# Altium project Scaffold.PrjPcb (part 1 of 2)
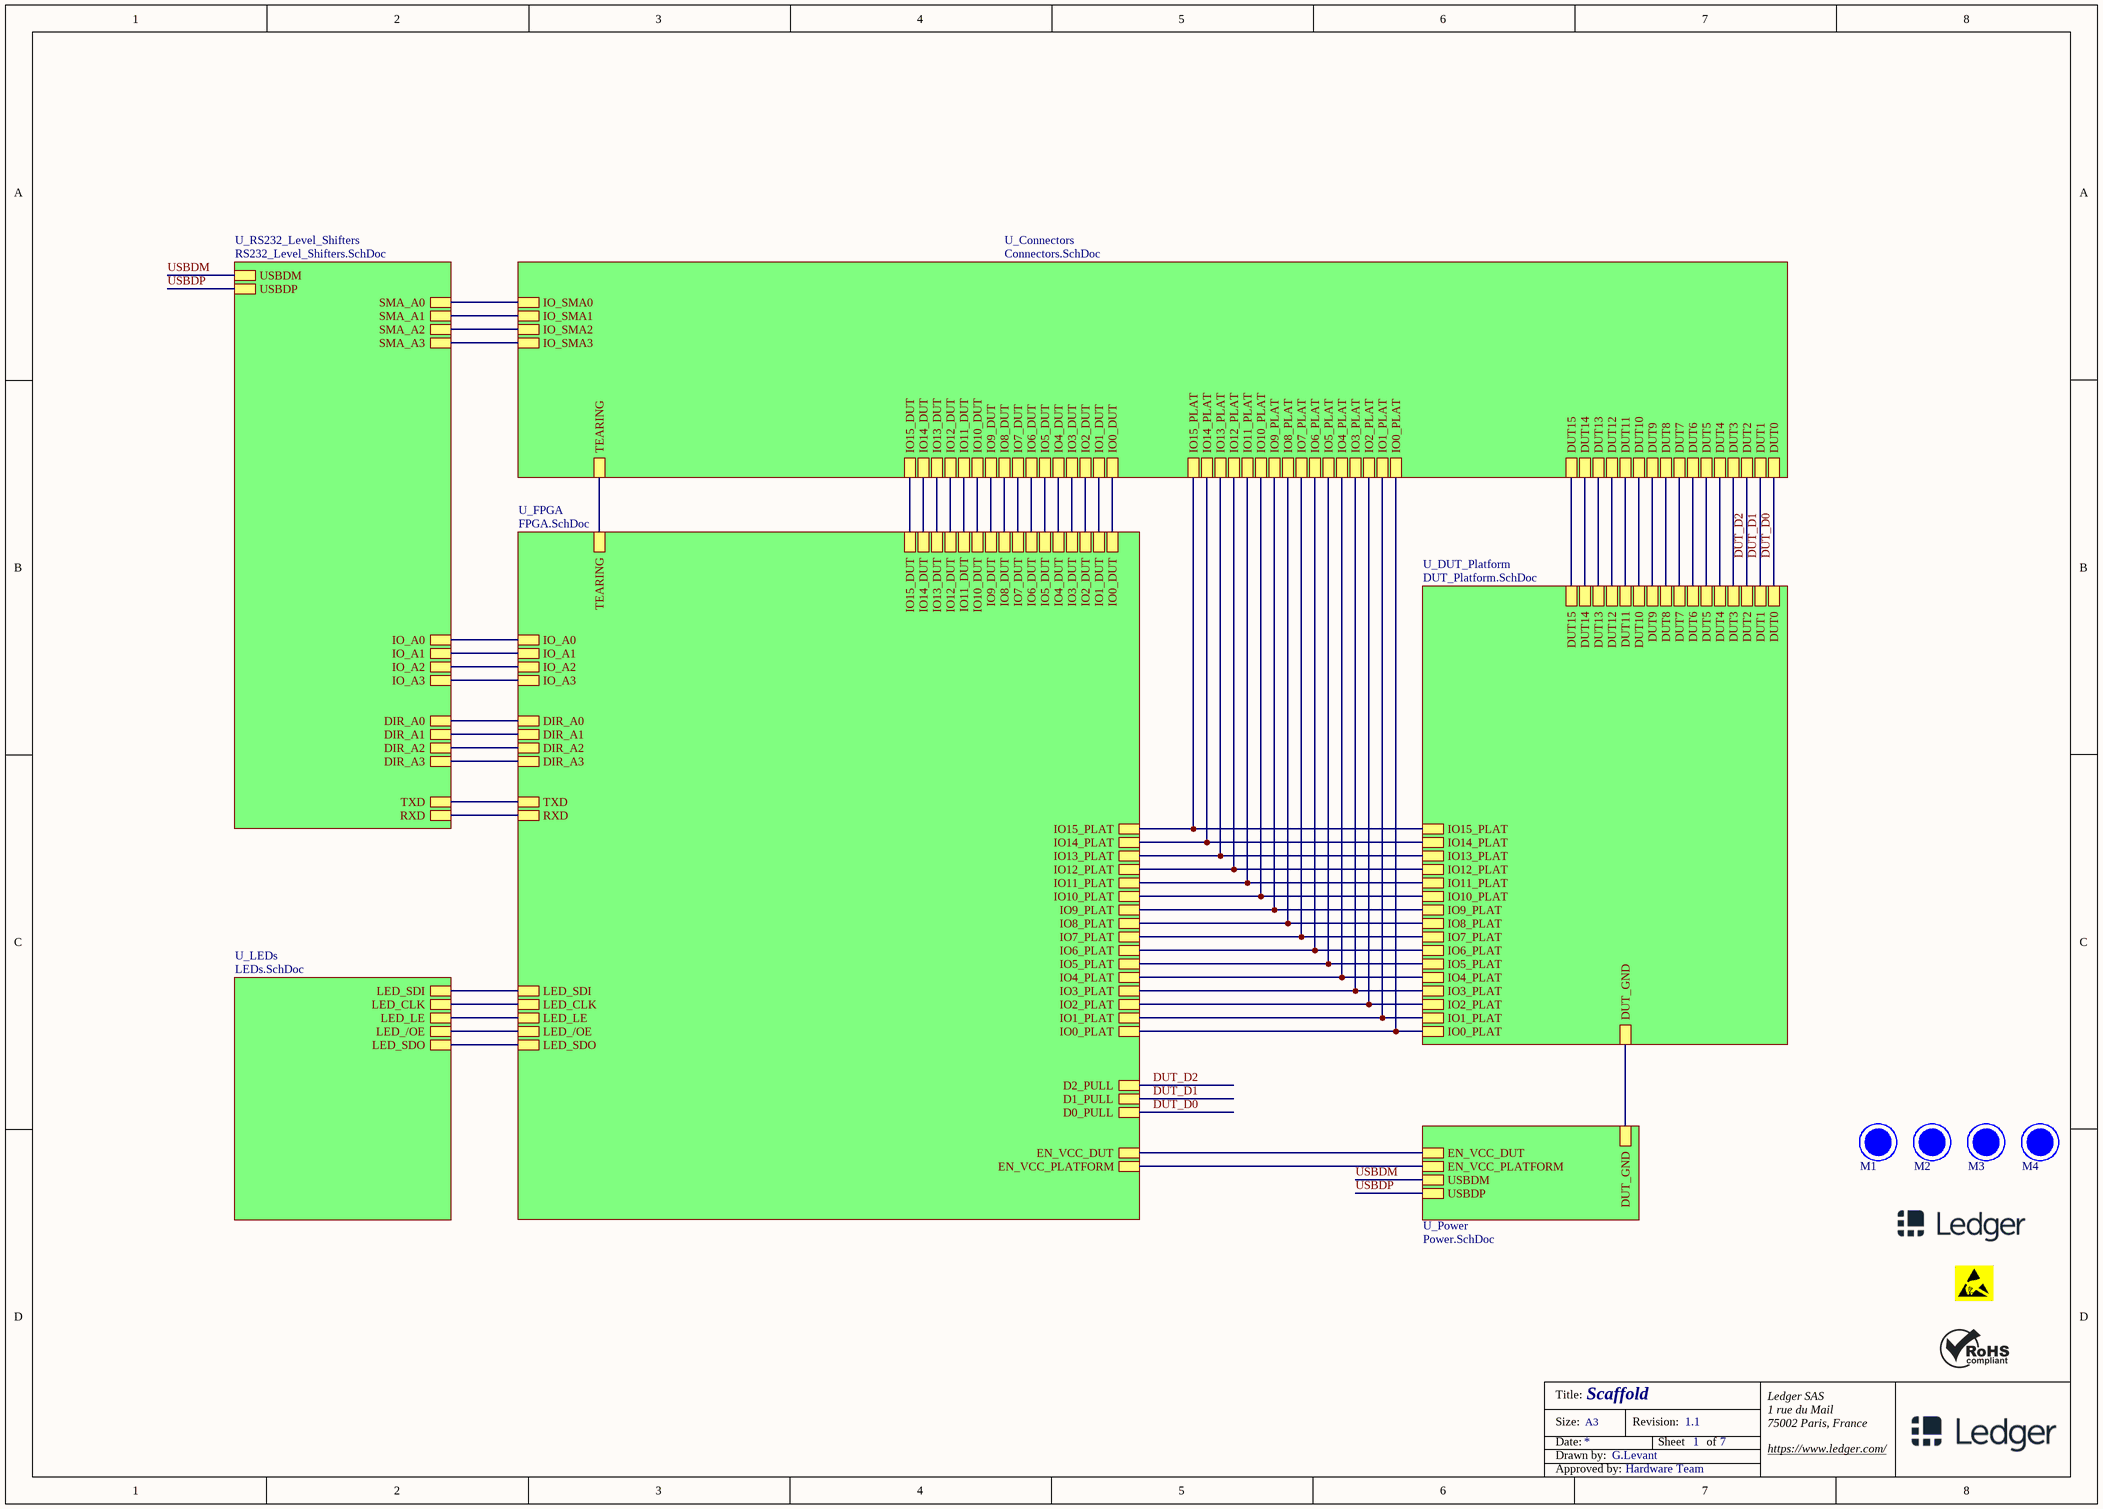
[diagram p0: Scaffold.SchDoc]
ELECApproved: Hardware Team; ELECDrawn: G.Levant; Nom_Projet: Scaffold; PageTot: 7; Rev: 1.1
7 sheets, 332 parts. Net scope: hierarchical (ports join the sheet entries above them; power ports are global).
Board file: Scaffold.PcbDoc
Sheets:
  Scaffold.SchDoc
    U_Power = Power.SchDoc
    U_LEDs = LEDs.SchDoc
    U_FPGA = FPGA.SchDoc
    U_DUT_Platform = DUT_Platform.SchDoc
    U_Connectors = Connectors.SchDoc
    U_RS232_Level_Shifters = RS232_Level_Shifters.SchDoc

## Sheet Scaffold.SchDoc
size A3; SheetNumber: 1; SheetTotal: 7

### Parts
Logo1  Logo Ledger  [logo_Ledger_new - Horizontale]  (value not drawn)  (no BOM)
Logo2  Logo ESD  [LOGO ESD]  (value not drawn)  (no BOM)
Logo3  Logo ROHS  [Logo ROHS]  (value not drawn)  (no BOM)
M1  Mire  [MIRE]  (value not drawn)  (no BOM)
M2  Mire  [MIRE]  (value not drawn)  (no BOM)
M3  Mire  [MIRE]  (value not drawn)  (no BOM)
M4  Mire  [MIRE]  (value not drawn)  (no BOM)

### Sub-sheets
U_Connectors = Connectors.SchDoc: IO_SMA1, IO_SMA0, IO_SMA3, IO_SMA2, TEARING, DUT3, DUT2, DUT1, DUT0, DUT5, DUT6, DUT7, IO3_DUT, IO2_DUT, IO1_DUT, IO0_DUT, IO4_DUT, IO5_DUT, IO6_DUT, IO7_DUT, DUT11, DUT10, DUT9, DUT8, DUT12, DUT13, DUT14, DUT15, IO11_DUT, IO10_DUT, IO9_DUT, IO8_DUT, IO12_DUT, IO13_DUT, IO14_DUT, IO15_DUT, IO8_PLAT, IO10_PLAT, IO12_PLAT, IO14_PLAT, IO9_PLAT, IO11_PLAT, IO13_PLAT, IO15_PLAT, IO0_PLAT, IO2_PLAT, IO4_PLAT, IO6_PLAT, IO1_PLAT, IO3_PLAT, IO5_PLAT, IO7_PLAT, DUT4
U_DUT_Platform = DUT_Platform.SchDoc: IO15_PLAT, IO14_PLAT, IO13_PLAT, IO12_PLAT, IO11_PLAT, IO10_PLAT, IO9_PLAT, IO8_PLAT, IO7_PLAT, IO6_PLAT, IO5_PLAT, IO4_PLAT, IO3_PLAT, IO2_PLAT, IO1_PLAT, IO0_PLAT, DUT7, DUT15, DUT14, DUT13, DUT12, DUT11, DUT10, DUT9, DUT8, DUT6, DUT5, DUT4, DUT3, DUT2, DUT1, DUT0, DUT_GND
U_FPGA = FPGA.SchDoc: EN_VCC_PLATFORM, EN_VCC_DUT, IO_A0, IO_A1, IO_A2, IO_A3, TEARING, LED_SDI, LED_CLK, LED_LE, LED_/OE, LED_SDO, IO0_DUT, IO0_PLAT, IO1_DUT, IO1_PLAT, IO2_DUT, IO2_PLAT, IO3_DUT, IO3_PLAT, IO11_DUT, IO11_PLAT, IO12_DUT, IO12_PLAT, IO13_DUT, IO13_PLAT, IO14_DUT, IO14_PLAT, IO15_DUT, IO15_PLAT, IO7_DUT, IO7_PLAT, IO8_DUT, IO8_PLAT, IO9_DUT, IO9_PLAT, IO10_DUT, IO10_PLAT, IO4_DUT, IO4_PLAT, IO5_DUT, IO5_PLAT, IO6_DUT, IO6_PLAT, RXD, TXD, DIR_A1, DIR_A0, DIR_A2, DIR_A3, D2_PULL, D1_PULL, D0_PULL
U_LEDs = LEDs.SchDoc: LED_SDI, LED_CLK, LED_/OE, LED_LE, LED_SDO
U_Power = Power.SchDoc: DUT_GND, EN_VCC_DUT, EN_VCC_PLATFORM, USBDM, USBDP
U_RS232_Level_Shifters = RS232_Level_Shifters.SchDoc: USBDM, USBDP, SMA_A0, SMA_A1, RXD, TXD, IO_A0, IO_A1, IO_A2, SMA_A2, IO_A3, SMA_A3, DIR_A1, DIR_A0, DIR_A2, DIR_A3

### Nets
DUT_D0: sheet U_FPGA/D0_PULL, sheet U_DUT_Platform/DUT0, sheet U_Connectors/DUT0
DUT_D1: sheet U_FPGA/D1_PULL, sheet U_DUT_Platform/DUT1, sheet U_Connectors/DUT1
DUT_D2: sheet U_FPGA/D2_PULL, sheet U_DUT_Platform/DUT2, sheet U_Connectors/DUT2
IO0_DUT: sheet U_FPGA/IO0_DUT, sheet U_Connectors/IO0_DUT
IO1_DUT: sheet U_FPGA/IO1_DUT, sheet U_Connectors/IO1_DUT
IO2_DUT: sheet U_FPGA/IO2_DUT, sheet U_Connectors/IO2_DUT
IO3_DUT: sheet U_FPGA/IO3_DUT, sheet U_Connectors/IO3_DUT
IO4_DUT: sheet U_FPGA/IO4_DUT, sheet U_Connectors/IO4_DUT
IO5_DUT: sheet U_FPGA/IO5_DUT, sheet U_Connectors/IO5_DUT
IO6_DUT: sheet U_FPGA/IO6_DUT, sheet U_Connectors/IO6_DUT
IO7_DUT: sheet U_FPGA/IO7_DUT, sheet U_Connectors/IO7_DUT
IO8_DUT: sheet U_FPGA/IO8_DUT, sheet U_Connectors/IO8_DUT
IO9_DUT: sheet U_FPGA/IO9_DUT, sheet U_Connectors/IO9_DUT
IO10_DUT: sheet U_FPGA/IO10_DUT, sheet U_Connectors/IO10_DUT
IO11_DUT: sheet U_FPGA/IO11_DUT, sheet U_Connectors/IO11_DUT
IO12_DUT: sheet U_FPGA/IO12_DUT, sheet U_Connectors/IO12_DUT
IO13_DUT: sheet U_FPGA/IO13_DUT, sheet U_Connectors/IO13_DUT
IO14_DUT: sheet U_FPGA/IO14_DUT, sheet U_Connectors/IO14_DUT
IO15_DUT: sheet U_FPGA/IO15_DUT, sheet U_Connectors/IO15_DUT
LED_/OE: sheet U_LEDs/LED_/OE, sheet U_FPGA/LED_/OE
LED_CLK: sheet U_LEDs/LED_CLK, sheet U_FPGA/LED_CLK
LED_LE: sheet U_LEDs/LED_LE, sheet U_FPGA/LED_LE
USBDM: sheet U_Power/USBDM, sheet U_RS232_Level_Shifters/USBDM
USBDP: sheet U_Power/USBDP, sheet U_RS232_Level_Shifters/USBDP
NetCN207_1: sheet U_Power/DUT_GND, sheet U_DUT_Platform/DUT_GND
NetJ500_1: sheet U_FPGA/IO1_PLAT, sheet U_DUT_Platform/IO1_PLAT, sheet U_Connectors/IO1_PLAT
NetJ500_2: sheet U_FPGA/IO0_PLAT, sheet U_DUT_Platform/IO0_PLAT, sheet U_Connectors/IO0_PLAT
NetJ500_3: sheet U_FPGA/IO3_PLAT, sheet U_DUT_Platform/IO3_PLAT, sheet U_Connectors/IO3_PLAT
NetJ500_4: sheet U_FPGA/IO2_PLAT, sheet U_DUT_Platform/IO2_PLAT, sheet U_Connectors/IO2_PLAT
NetJ500_5: sheet U_FPGA/IO5_PLAT, sheet U_DUT_Platform/IO5_PLAT, sheet U_Connectors/IO5_PLAT
NetJ500_6: sheet U_FPGA/IO4_PLAT, sheet U_DUT_Platform/IO4_PLAT, sheet U_Connectors/IO4_PLAT
NetJ500_7: sheet U_FPGA/IO7_PLAT, sheet U_DUT_Platform/IO7_PLAT, sheet U_Connectors/IO7_PLAT
NetJ500_8: sheet U_FPGA/IO6_PLAT, sheet U_DUT_Platform/IO6_PLAT, sheet U_Connectors/IO6_PLAT
NetJ500_9: sheet U_FPGA/IO9_PLAT, sheet U_DUT_Platform/IO9_PLAT, sheet U_Connectors/IO9_PLAT
NetJ500_10: sheet U_FPGA/IO8_PLAT, sheet U_DUT_Platform/IO8_PLAT, sheet U_Connectors/IO8_PLAT
NetJ500_11: sheet U_FPGA/IO11_PLAT, sheet U_DUT_Platform/IO11_PLAT, sheet U_Connectors/IO11_PLAT
NetJ500_12: sheet U_FPGA/IO10_PLAT, sheet U_DUT_Platform/IO10_PLAT, sheet U_Connectors/IO10_PLAT
NetJ500_13: sheet U_FPGA/IO13_PLAT, sheet U_DUT_Platform/IO13_PLAT, sheet U_Connectors/IO13_PLAT
NetJ500_14: sheet U_FPGA/IO12_PLAT, sheet U_DUT_Platform/IO12_PLAT, sheet U_Connectors/IO12_PLAT
NetJ500_15: sheet U_FPGA/IO15_PLAT, sheet U_DUT_Platform/IO15_PLAT, sheet U_Connectors/IO15_PLAT
NetJ500_16: sheet U_FPGA/IO14_PLAT, sheet U_DUT_Platform/IO14_PLAT, sheet U_Connectors/IO14_PLAT
NetJ503_3: sheet U_DUT_Platform/DUT3, sheet U_Connectors/DUT3
NetJ503_5: sheet U_DUT_Platform/DUT5, sheet U_Connectors/DUT5
NetJ503_6: sheet U_DUT_Platform/DUT4, sheet U_Connectors/DUT4
NetJ503_7: sheet U_DUT_Platform/DUT7, sheet U_Connectors/DUT7
NetJ503_8: sheet U_DUT_Platform/DUT6, sheet U_Connectors/DUT6
NetJ503_9: sheet U_DUT_Platform/DUT9, sheet U_Connectors/DUT9
NetJ503_10: sheet U_DUT_Platform/DUT8, sheet U_Connectors/DUT8
NetJ503_11: sheet U_DUT_Platform/DUT11, sheet U_Connectors/DUT11
NetJ503_12: sheet U_DUT_Platform/DUT10, sheet U_Connectors/DUT10
NetJ503_13: sheet U_DUT_Platform/DUT13, sheet U_Connectors/DUT13
NetJ503_14: sheet U_DUT_Platform/DUT12, sheet U_Connectors/DUT12
NetJ503_15: sheet U_DUT_Platform/DUT15, sheet U_Connectors/DUT15
NetJ503_16: sheet U_DUT_Platform/DUT14, sheet U_Connectors/DUT14
NetQ202_3: sheet U_Power/EN_VCC_PLATFORM, sheet U_FPGA/EN_VCC_PLATFORM
NetQ205_3: sheet U_Power/EN_VCC_DUT, sheet U_FPGA/EN_VCC_DUT
NetR300_1: sheet U_FPGA/TEARING, sheet U_Connectors/TEARING
NetR336_1: sheet U_Connectors/IO_SMA2, sheet U_RS232_Level_Shifters/SMA_A2
NetR337_1: sheet U_Connectors/IO_SMA3, sheet U_RS232_Level_Shifters/SMA_A3
NetR344_1: sheet U_Connectors/IO_SMA0, sheet U_RS232_Level_Shifters/SMA_A0
NetR345_1: sheet U_Connectors/IO_SMA1, sheet U_RS232_Level_Shifters/SMA_A1
NetR600_1: sheet U_FPGA/DIR_A0, sheet U_RS232_Level_Shifters/DIR_A0
NetR601_1: sheet U_FPGA/DIR_A1, sheet U_RS232_Level_Shifters/DIR_A1
NetR602_1: sheet U_FPGA/DIR_A2, sheet U_RS232_Level_Shifters/DIR_A2
NetR604_1: sheet U_FPGA/DIR_A3, sheet U_RS232_Level_Shifters/DIR_A3
NetTP403_1: sheet U_LEDs/LED_SDI, sheet U_FPGA/LED_SDI
NetTP405_1: sheet U_LEDs/LED_SDO, sheet U_FPGA/LED_SDO
NetTP600_1: sheet U_FPGA/RXD, sheet U_RS232_Level_Shifters/RXD
NetTP602_1: sheet U_FPGA/TXD, sheet U_RS232_Level_Shifters/TXD
NetU100_30: sheet U_FPGA/IO_A0, sheet U_RS232_Level_Shifters/IO_A0
NetU100_31: sheet U_FPGA/IO_A1, sheet U_RS232_Level_Shifters/IO_A1
NetU100_32: sheet U_FPGA/IO_A2, sheet U_RS232_Level_Shifters/IO_A2
NetU100_33: sheet U_FPGA/IO_A3, sheet U_RS232_Level_Shifters/IO_A3

### Notes on the sheet
- Title:
- Size:
- Date:
- Drawn by:
- A3
- Revision:
- Sheet
- of
- Ledger SAS
- 1 rue du Mail
- 75002 Paris, France
- https://www.ledger.com/
- Approved by:

### Library data of the parts
Logo1 = Misc - Logo Ledger: Misc -  Logo Ledger
Logo2 = Misc - Logo ESD: Misc -  Logo ESD
Logo3 = Misc - Logo ROHS: Misc -  Logo ROHS
M1-M4 = Misc - Mire: Misc -  Mire

## Sheet Power.SchDoc
size A3; SheetNumber: 3; SheetTotal: 7
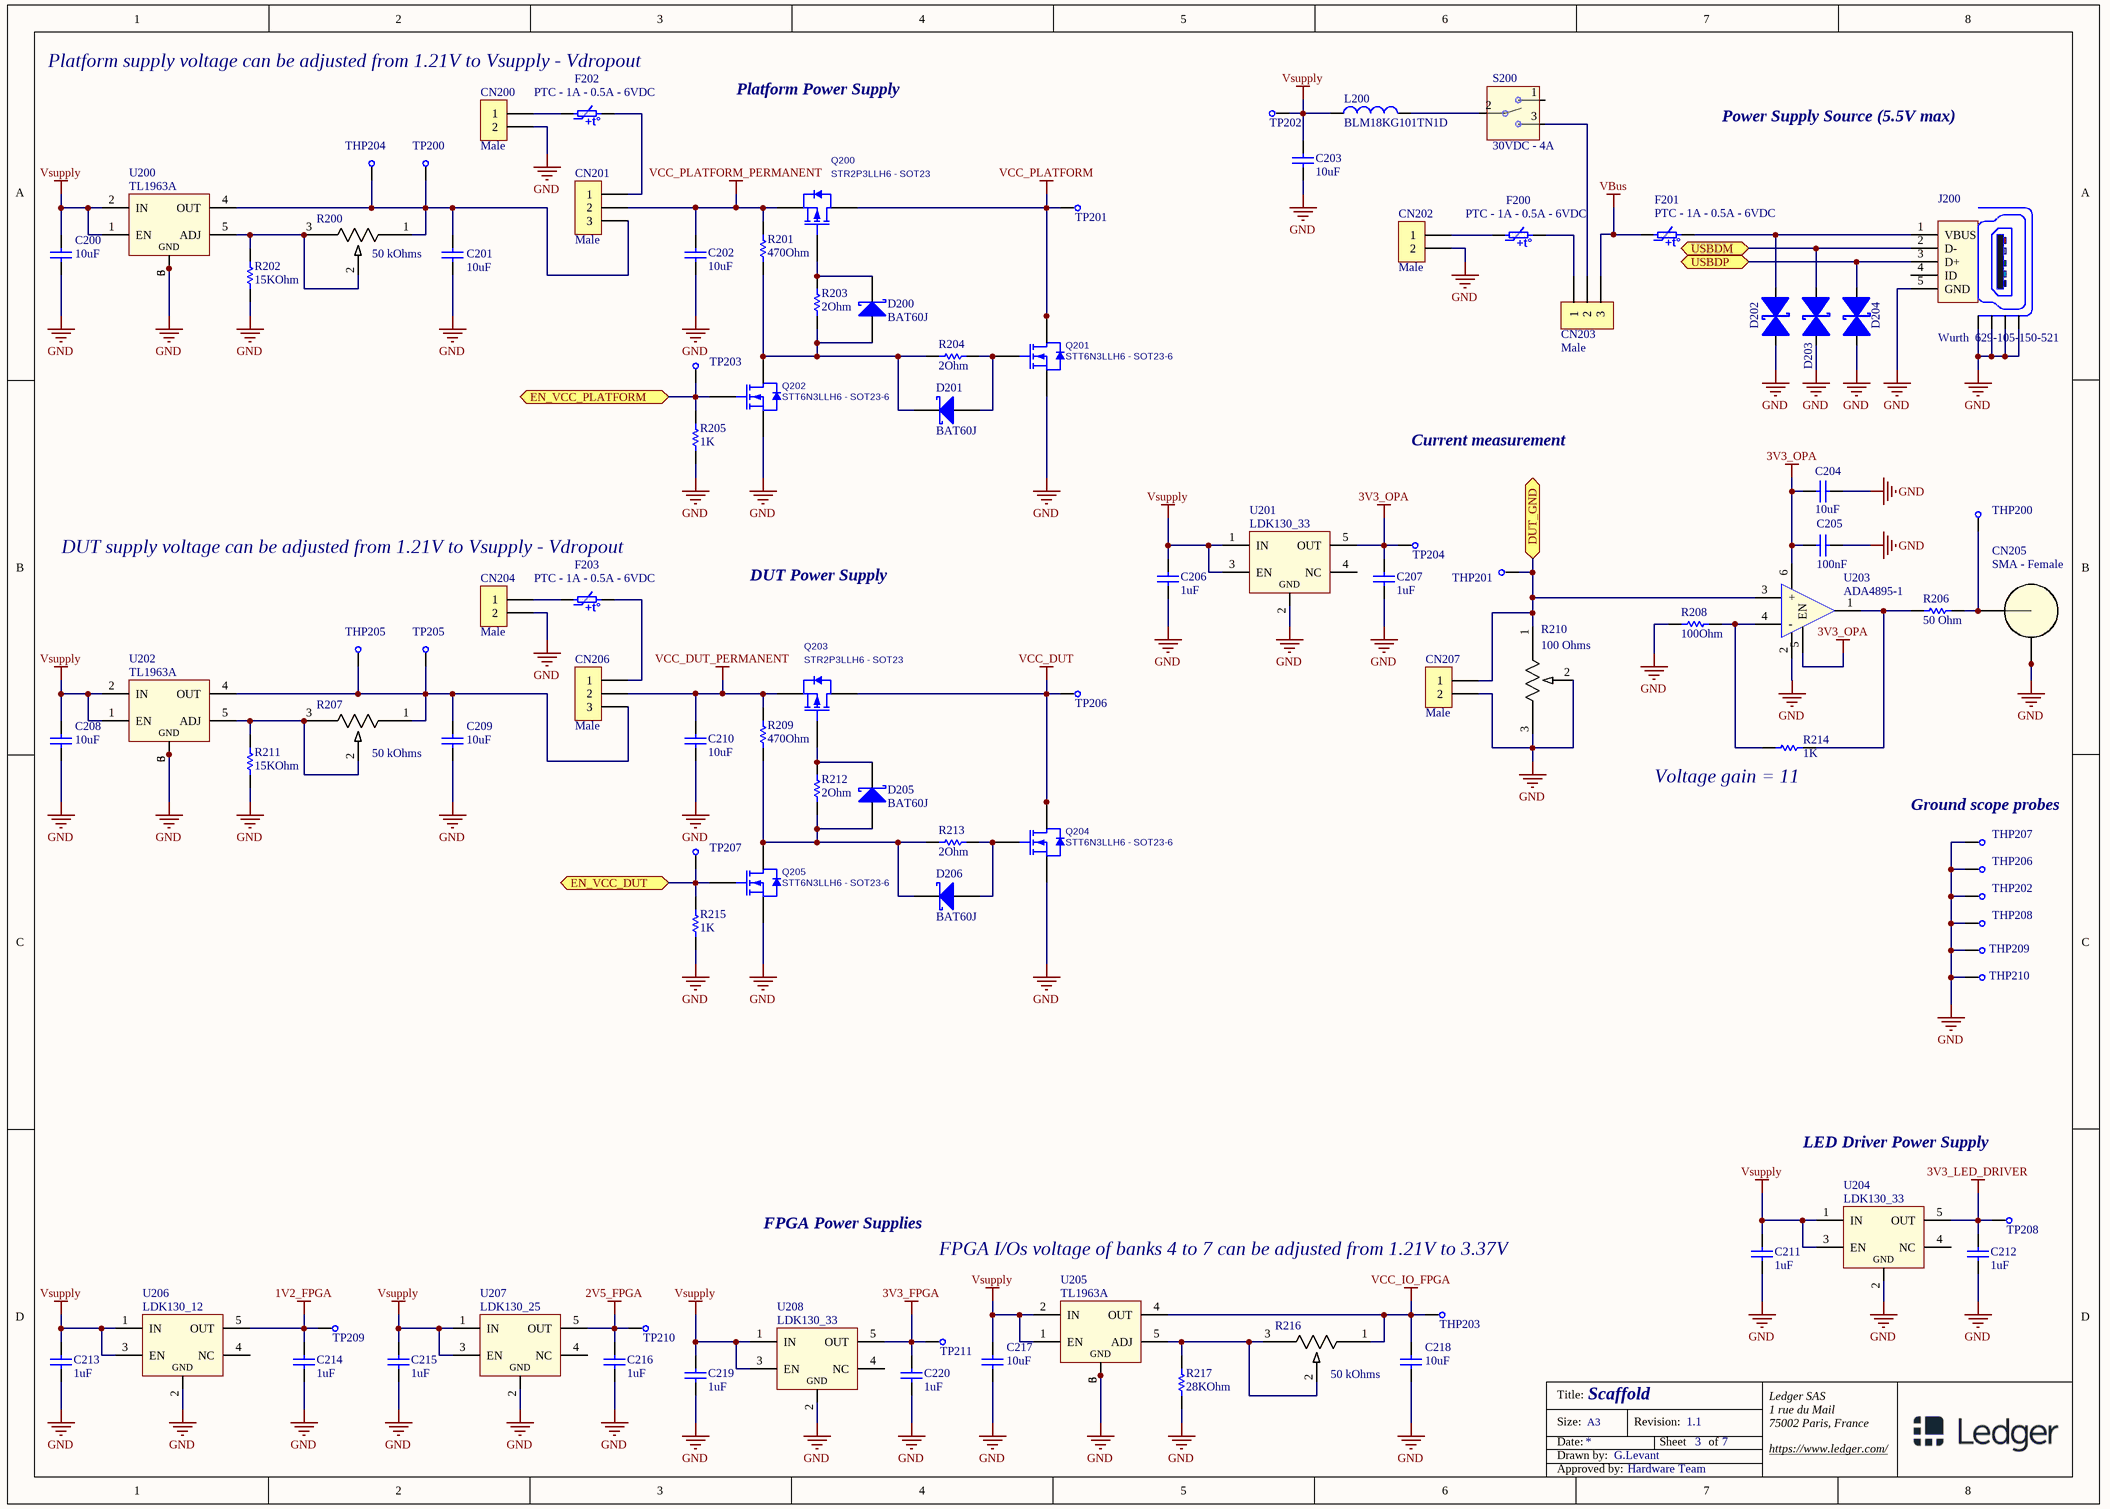
[diagram p1: Power.SchDoc]

### Parts
C200  10uF  [CAP0603]
C201  10uF  [CAP0603]
C202  10uF  [CAP0603]
C203  10uF  [CAP0603]
C204  10uF  [CAP0603]
C205  100nF  [CAP0603]
C206  1uF  [CAP0603]
C207  1uF  [CAP0603]
C208  10uF  [CAP0603]
C209  10uF  [CAP0603]
C210  10uF  [CAP0603]
C211  1uF  [CAP0603]
C212  1uF  [CAP0603]
C213  1uF  [CAP0603]
C214  1uF  [CAP0603]
C215  1uF  [CAP0603]
C216  1uF  [CAP0603]
C217  10uF  [CAP0603]
C218  10uF  [CAP0603]
C219  1uF  [CAP0603]
C220  1uF  [CAP0603]
CN200  Male  [WURTH_691213710002]
CN201  Male  [MOLEX_90120-0123]
CN202  Male  [WURTH_691213710002]
CN203  Male  [MOLEX_90120-0123]
CN204  Male  [WURTH_691213710002]
CN205  SMA - Female  [SAMTEC_SMA-J-P-X-ST-EM3]
CN206  Male  [MOLEX_90120-0123]
CN207  Male  [MOLEX_90120-0122]
D200  BAT60J  [SOD323/A]
D201  BAT60J  [SOD323/A]
D202  ESDAXLC6-1BT2  [SOD882]  (value not drawn)
D203  ESDAXLC6-1BT2  [SOD882]  (value not drawn)
D204  ESDAXLC6-1BT2  [SOD882]  (value not drawn)
D205  BAT60J  [SOD323/A]
D206  BAT60J  [SOD323/A]
F200  PTC - 1A - 0.5A - 6VDC  [FUSE_0805]
F201  PTC - 1A - 0.5A - 6VDC  [FUSE_0805]
F202  PTC - 1A - 0.5A - 6VDC  [FUSE_0805]
F203  PTC - 1A - 0.5A - 6VDC  [FUSE_0805]
J200  Wurth  629-105-150-521  [629105150521]
L200  BLM18KG101TN1D  [0603]
Logo200  Misc - Logo Increase clockwise  [LOGO_CLOCKWISE_INCREASE]  (value not drawn)  (no BOM)
Logo201  Misc - Logo Increase clockwise  [LOGO_CLOCKWISE_INCREASE]  (value not drawn)  (no BOM)
Logo202  Misc - Logo Increase clockwise  [LOGO_CLOCKWISE_INCREASE]  (value not drawn)  (no BOM)
Logo203  Misc - Logo Increase clockwise  [LOGO_CLOCKWISE_INCREASE]  (value not drawn)  (no BOM)
Q200  STR2P3LLH6 - SOT23  [SOT23]
Q201  STT6N3LLH6 - SOT23-6  [SOT95P280X145-6N]
Q202  STT6N3LLH6 - SOT23-6  [SOT95P280X145-6N]
Q203  STR2P3LLH6 - SOT23  [SOT23]
Q204  STT6N3LLH6 - SOT23-6  [SOT95P280X145-6N]
Q205  STT6N3LLH6 - SOT23-6  [SOT95P280X145-6N]
R200  50 kOhms  [POT_3296W]
R201  470Ohm  [RES0603]
R202  15KOhm  [RES0603]
R203  2Ohm  [RES0603]
R204  2Ohm  [RES0603]
R205  1K  [RES0603]
R206  50 Ohm  [RES0603]
R207  50 kOhms  [POT_3296W]
R208  100Ohm  [RES0603]
R209  470Ohm  [RES0603]
R210  100 Ohms  [POT_3296W]
R211  15KOhm  [RES0603]
R212  2Ohm  [RES0603]
R213  2Ohm  [RES0603]
R214  1K  [RES0603]
R215  1K  [RES0603]
R216  50 kOhms  [POT_3296W]
R217  28KOhm  [RES0603]
S200  30VDC - 4A  [SWITCH_25136NAH]
THP200  Misc - Test pin - Through hole - Millmax - 6821-0-00-15-00-00-08-0  [MILLMAX_6821-0-00-15-00-00-08-0]  (value not drawn)
THP201  Misc - Test pin - Through hole - Millmax - 6821-0-00-15-00-00-08-0  [MILLMAX_6821-0-00-15-00-00-08-0]  (value not drawn)
THP202  Misc - Test pin - Through hole - Millmax - 6821-0-00-15-00-00-08-0  [MILLMAX_6821-0-00-15-00-00-08-0]  (value not drawn)
THP203  Misc - Test pin - Through hole - Millmax - 6821-0-00-15-00-00-08-0  [MILLMAX_6821-0-00-15-00-00-08-0]  (value not drawn)
THP204  Misc - Test pin - Through hole - Millmax - 6821-0-00-15-00-00-08-0  [MILLMAX_6821-0-00-15-00-00-08-0]  (value not drawn)
THP205  Misc - Test pin - Through hole - Millmax - 6821-0-00-15-00-00-08-0  [MILLMAX_6821-0-00-15-00-00-08-0]  (value not drawn)
THP206  Misc - Test pin - Through hole - Millmax - 6821-0-00-15-00-00-08-0  [MILLMAX_6821-0-00-15-00-00-08-0]  (value not drawn)
THP207  Misc - Test pin - Through hole - Millmax - 6821-0-00-15-00-00-08-0  [MILLMAX_6821-0-00-15-00-00-08-0]  (value not drawn)
THP208  Misc - Test pin - Through hole - Millmax - 6821-0-00-15-00-00-08-0  [MILLMAX_6821-0-00-15-00-00-08-0]  (value not drawn)
THP209  Misc - Test pin - Through hole - Millmax - 6821-0-00-15-00-00-08-0  [MILLMAX_6821-0-00-15-00-00-08-0]  (value not drawn)
THP210  Misc - Test pin - Through hole - Millmax - 6821-0-00-15-00-00-08-0  [MILLMAX_6821-0-00-15-00-00-08-0]  (value not drawn)
TP200  (no value)  [TP_001]  (no BOM)
TP201  (no value)  [TP_001]  (no BOM)
TP202  (no value)  [TP_001]  (no BOM)
TP203  (no value)  [TP_001]  (no BOM)
TP204  (no value)  [TP_001]  (no BOM)
TP205  (no value)  [TP_001]  (no BOM)
TP206  (no value)  [TP_001]  (no BOM)
TP207  (no value)  [TP_001]  (no BOM)
TP208  (no value)  [TP_001]  (no BOM)
TP209  (no value)  [TP_001]  (no BOM)
TP210  (no value)  [TP_001]  (no BOM)
TP211  (no value)  [TP_001]  (no BOM)
U200  TL1963A  [SOT223-6]
U201  LDK130_33  [SOT95P280X145-5L30]
U202  TL1963A  [SOT223-6]
U203  ADA4895-1  [SOT95P280X145-6N]
U204  LDK130_33  [SOT95P280X145-5L30]
U205  TL1963A  [SOT223-6]
U206  LDK130_12  [SOT95P280X145-5L30]
U207  LDK130_25  [SOT95P280X145-5L30]
U208  LDK130_33  [SOT95P280X145-5L30]

### Ports
DUT_GND, EN_VCC_DUT, EN_VCC_PLATFORM, USBDM, USBDP

### Nets
1V2_FPGA: C214.2 TP209.1 U206.5(OUT)
2V5_FPGA: C216.2 TP210.1 U207.5(OUT)
3V3_FPGA: C220.2 TP211.1 U208.5(OUT)
3V3_LED_DRIVER: C212.2 TP208.1 U204.5(OUT)
3V3_OPA: C204.1 C205.1 C207.2 TP204.1 U201.5(OUT) U203.5(EN) U203.6(VS+)
GND: C200.1 C201.1 C202.1 C203.1 C204.2 C205.2 C206.1 C207.1 C208.1 C209.1 C210.1 C211.1 C212.1 C213.1 C214.1 C215.1 C216.1 C217.1 C218.1 C219.1 C220.1 CN200.2 CN202.2 CN204.2 CN205.2 CN205.3 CN207.2 D202.A D203.A D204.A J200.5(GND) J200.Z1(Shield) J200.Z2(Shield) J200.Z3(Shield) J200.Z4(Shield) Q201.4(S) Q202.4(S) Q204.4(S) Q205.4(S) R202.1 R205.1 R208.1 R210.2 R210.3 R211.1 R215.1 R217.1 THP202.1 THP206.1 THP207.1 THP208.1 THP209.1 THP210.1 U200.3(GND) U200.6(GND) U201.2(GND) U202.3(GND) U202.6(GND) U203.2(GND) U204.2(GND) U205.3(GND) U205.6(GND) U206.2(GND) U207.2(GND) U208.2(GND)
VBus: CN203.3 F201.1
VCC_DUT: Q203.3(D) Q204.1(D) Q204.2(D) Q204.5(D) Q204.6(D) TP206.1
VCC_DUT_PERMANENT: C210.2 CN206.2 Q203.2(S) R209.2
VCC_IO_FPGA: C218.2 R216.1 THP203.1 U205.4(OUT)
VCC_PLATFORM: Q200.3(D) Q201.1(D) Q201.2(D) Q201.5(D) Q201.6(D) TP201.1
VCC_PLATFORM_PERMANENT: C202.2 CN201.2 Q200.2(S) R201.2
Vsupply: C200.2 C203.2 C206.2 C208.2 C211.2 C213.2 C215.2 C217.2 C219.2 L200.1 TP202.1 U200.1(EN) U200.2(IN) U201.1(IN) U201.3(EN) U202.1(EN) U202.2(IN) U204.1(IN) U204.3(EN) U205.1(EN) U205.2(IN) U206.1(IN) U206.3(EN) U207.1(IN) U207.3(EN) U208.1(IN) U208.3(EN)
USBDM: D203.C(K) J200.2(D-) ; port USBDM
USBDP: D204.C(K) J200.3(D+) ; port USBDP
NetC201_2: C201.2 CN201.3 R200.1 THP204.1 TP200.1 U200.4(OUT)
NetC209_2: C209.2 CN206.3 R207.1 THP205.1 TP205.1 U202.4(OUT)
NetCN200_1: CN200.1 F202.1
NetCN201_1: CN201.1 F202.2
NetCN202_1: CN202.1 F200.1
NetCN203_1: CN203.1 F200.2
NetCN203_2: CN203.2 S200.3
NetCN204_1: CN204.1 F203.1
NetCN205_1: CN205.1 R206.2 THP200.1
NetCN206_1: CN206.1 F203.2
NetCN207_1: CN207.1 R210.1 THP201.1 U203.3(+) ; port DUT_GND
NetD200_1: D200.1(A) D201.2(K) Q202.1(D) Q202.2(D) Q202.5(D) Q202.6(D) R201.1 R203.1 R204.1
NetD200_2: D200.2(K) Q200.1(G) R203.2
NetD201_1: D201.1(A) Q201.3(G) R204.2
NetD202_C: D202.C(K) F201.2 J200.1(VBUS)
NetD205_1: D205.1(A) D206.2(K) Q205.1(D) Q205.2(D) Q205.5(D) Q205.6(D) R209.1 R212.1 R213.1
NetD205_2: D205.2(K) Q203.1(G) R212.2
NetD206_1: D206.1(A) Q204.3(G) R213.2
NetL200_2: L200.2 S200.2
NetQ202_3: Q202.3(G) R205.2 TP203.1 ; port EN_VCC_PLATFORM
NetQ205_3: Q205.3(G) R215.2 TP207.1 ; port EN_VCC_DUT
NetR200_2: R200.2 R200.3 R202.2 U200.5(ADJ)
NetR206_1: R206.1 R214.2 U203.1(Out)
NetR207_2: R207.2 R207.3 R211.2 U202.5(ADJ)
NetR208_2: R208.2 R214.1 U203.4(-)
NetR216_2: R216.2 R216.3 R217.2 U205.5(ADJ)

Not connected (* = marked no-connect by the designer): J200 4(ID); S200 1; U201 4(NC); U204 4(NC); U206 4(NC); U207 4(NC); U208 4(NC)

### Notes on the sheet
- Platform supply voltage can be adjusted from 1.21V to Vsupply - Vdropout
- Platform Power Supply
- Power Supply Source (5.5V max)
- Current measurement
- DUT supply voltage can be adjusted from 1.21V to Vsupply - Vdropout
- DUT Power Supply
- (near R214) Voltage gain = 11
- (near THP207) Ground scope probes
- LED Driver Power Supply
- FPGA Power Supplies
- FPGA I/Os voltage of banks 4 to 7 can be adjusted from 1.21V to 3.37V
- Title:
- Size:
- Date:
- Drawn by:
- A3
- Revision:
- Sheet
- of
- Ledger SAS
- 1 rue du Mail
- 75002 Paris, France
- https://www.ledger.com/
- Approved by:
- (in symbol Fuse 0805 - PTC Resettable - 1A - 0.5A - 6VDC - 0.9Ohms) +t°

### Library data of the parts
C200-C204 C208-C210 C217 C218 = Capacitor 0603 - 10uF - 16V - X5R - 20%: Manufacturer: Murata; Manufacturer PN: GRM188R61C106MA73D; Manufacturer1: TDK; Manufacturer1 PN: C1608X5R1C106M080AB; Manufacturer2 PN: EMK107BBJ106MA-T; PkgCode: 0603; value: 10uF; Type: X5R; Power: 16V; Tolerance: 20%; Manufacturer2: Taiyo Yuden
C205 = Capacitor 0603 - 100nF - 16V - X7R - 10%: Manufacturer1: Yageo; Manufacturer1 PN: CC0603KRX7R7BB104; Manufacturer2 PN: MCCA000159; Manufacturer: Wurth; Manufacturer PN: 885012206046; PkgCode: 0603; Value: 100nF; Power: 16V; Type: X7R; Tolerance: 10%; Manufacturer2: Multicomp
C206 C207 C211-C216 C219 C220 = Capacitor 0603 -     1uF - 16V - X7R - 10%: Capacitor 0603 - 1uF - 16V - X7R - 10%; Manufacturer: Kemet; Manufacturer PN: C0603C105K4RACTU; Manufacturer1: Murata; Manufacturer1 PN: GCM188R71C105K; Manufacturer2 PN: 885012206052; PkgCode: 0603; Value: 1uF; Type: X7R; Power: 16V; Tolerance: 10%; Manufacturer2: Wurth
CN200 CN202 CN204 = Connector - Wire to Board Terminal Block - 2-Positions - Wurth - 691213710002: NoPins: 2; NoRows: 1; Pitch: 5; Manufacturer: Wurth; Manufacturer PN: 691213710002; Type: Wire to Board
CN201 CN203 CN206 = Connector - Header - 3-Pin - single row - Male - Molex_90120-0123: Manufacturer: Molex; NoPins: 3; NoRows: 1; Pitch: 2.54; Manufacturer PN: 90120-0123; Type: Male
CN205 = Connector - SMA - Female - Horizontal - Mid Mount - Samtec - SMA–J–P–H–ST–EM3: pin to pad: 1>S1 2>G1 3>G2; Impedance: 50 Ohms; Manufacturer: Samtec; Manufacturer PN: SMA–J–P–H–ST–EM3; Type: SMA; Gender: Female
CN207 = Connector - Header - 2-Pin - single row - Male - Molex: Manufacturer PN: 90120-0122; NoPins: 2; NoRows: 1; Pitch: 2.54; Manufacturer: Molex; Type: Male
D200 D201 D205 D206 = Diode -Schottky -10V - 3 A - SOD−323 - BAT60J: Manufacturer: STMicroelectronics; Power: 310mW; PgkCode: SOD-323; Manufacturer PN: BAT60J
D202-D204 = Diode - ESD -15kV -10GHz - ESDAXLC6-1BT2: Manufacturer: STMicroelectronics; Air discharge: 15kV; Body discharge: 8kV; Manufacturer PN: ESDAXLC6-1BT2; PgkCode: SOD882
F200-F203 = Fuse 0805 - PTC Resettable - 1A - 0.5A - 6VDC - 0.9Ohms: Manufacturer: Bel Fuse; Manufacturer PN: 0ZCK0050FF2E; Manufacturer1: Bourns; Manufacturer1 PN: MF-PSMF050X-2; Manufacturer2 PN: 0805L050WR; Max resistance: 900mOhms; Voltage: 6V; PkgCode: 0805; Trip current: 1A; Hold current: 0.5A; Manufacturer2: Littelfuse
J200 = Connector - USB - Micro B - Wurth: NoPins: 5; Manufacturer: Wurth; Manufacturer PN: 629-105-150-521; Type: Micro B
L200 = Ferrite - Bead - 0603 BLM18: Manufacturer: MURATA; Impedance: 100Ohms; Rated Current: 1 A; DC Resistance: 30 mOhms; Manufacturer PN: BLM18KG101TN1D; Pkgref: 0603
Q200 Q203 = Switch - PMOS 30V - STR2P3LLH6 - SOT23: Manufacturer: STMicroelectronics; Manufacturer1: ON Semiconductor; Manufacturer1 PN: CPH3355-TL-W; Manufacturer2 PN: SI2307-TP; ID max (continuous): 2A; VGSmax: 20V; PkgRef: SOT23; Manufacturer PN: STR2P3LLH6; VDSmax: 30V; Manufacturer2: MCC
Q201 Q202 Q204 Q205 = Switch - NMOS 30V - STT6N3LLH6 - SOT23-6: Manufacturer: STMicroelectronics; ID max (continuous): 6A; VGSmax: 20V; PkgRef: SOT23-6; Manufacturer PN: STT6N3LLH6; VDSmax: 30V
R200 R207 R216 = Potentiometer - 50 kOhms - 10% - 0.5W - Bourns - 3296W-1-503RLF: Manufacturer: Bourns Electronics; Turn: 25; Manufacturer PN: 3296W-1-503RLF; Value: 50 kOhms; Power: 0.5W; Tolerance: 10%
R201 R209 = Resistor 0603 -    470Ohm - 1/10W - 1%: Manufacturer: Yageo; Manufacturer PN: RC0603FR-07470RP; Manufacturer1: Panasonic; Manufacturer1 PN: ERJ3EKF4700; Manufacturer2 PN: RK73H1JTTD4700F; PkgCode: 0603; Value: 470Ohm; Tolerance: 1%; Power: 1/10W; Manufacturer2: KOA Speer
R202 R211 = Resistor 0603 -    15KOhm - 1/10W - 1%: Manufacturer: Yageo; Manufacturer PN: RC0603FR-1015KL; Manufacturer1: Panasonic; Manufacturer1 PN: ERJ3EKF1502; Manufacturer2 PN: RK73H1JHT..1502F; PkgCode: 0603; Value: 15KOhm; Tolerance: 1%; Power: 1/10W; Manufacturer2: KOA Speer
R203 R204 R212 R213 = Resistor 0603 -      2Ohm - 1/10W - 1%: Resistor 0603 - 2Ohm - 1/10W - 1%; Manufacturer: Vishay; Manufacturer PN: CRCW06032R00FKEA; PkgCode: 0603; Value: 2Ohm; Tolerance: 1%; Power: 1/10W
R205 R214 R215 = Resistor 0603 -      1KOhm - 1/10W - 1%: Resistor 0603 - 1KOhm - 1/10W - 1%; Manufacturer: Yageo; Manufacturer PN: RC0603FR-071KL; PkgCode: 0603; Value: 1K; Tolerance: 1%; Power: 1/10W
R206 = Resistor 0603 -  50Ohm - 1/10W - 1%: Manufacturer PN: CRCW060350R0FKEA; Manufacturer: Vishay; PkgCode: 0603; Value: 50 Ohm; Power: 1/10W; Tolerance: 1%
R208 = Resistor 0603 -    100Ohm - 1/10W - 1%: Manufacturer: Vishay; Manufacturer PN: CRCW0603100RFKEA; PkgCode: 0603; Value: 100Ohm; Tolerance: 1%; Power: 1/10W
R210 = Potentiometer - 100 Ohms - 25 turns - 10% - 0.5W - Bourns - 3296W-1-101LF: Manufacturer: Bourns Electronics; turns: 25; Manufacturer PN: 3296W-1-101LF; Value: 100 Ohms; Power: 0.5W; Tolerance: 10%
R217 = Resistor 0603 -    28KOhm - 1/10W - 1%: Manufacturer: Yageo; Manufacturer PN: AC0603FR-0728KL; Manufacturer1: Panasonic; Manufacturer1 PN: ERJ3EKF2802; Manufacturer2 PN: RK73H1JHT..2802F; PkgCode: 0603; Value: 28KOhm; Tolerance: 1%; Power: 1/10W; Manufacturer2: KOA Speer
S200 = Slide switch - 4A - 30VDC - APEM - 25136NAH: Manufacturer: APEM; Manufacturer PN: 25136NAH; Current: 4A
THP200-THP210 = Misc - Test pin - Through hole - Millmax - 6821-0-00-15-00-00-08-0: Manufacturer: Mill-max; Manufacturer PN: 6821-0-00-15-00-00-08-0
TP200-TP211 = Misc - Test point CMS
U200 U202 U205 = Power - LDO - Adj - 20V - 1.5A - SOT223-6: Manufacturer PN: TL1963ADCQR; Manufacturer: Texas Instruments; Tolerance: 70mV; PkgCode: SOT223-6; Value: ADJ; Power: 1.5A
U201 U204 U208 = Power - LDO - 3.3V - 300 mA - SOT23-5L: Manufacturer PN: LDK130M33R; Manufacturer: STMicroelectronics; Power: 300mA; Tolerance: 3%; PkgCode: SOT23-5L; Value: 3.3V
U203 = Power - Operationnal amplifier - ADA4895-1: Manufacturer: Analog Device; Manufacturer PN: ADA4895-1ARJZ-R; Gain: 95 dB; PkgCode: SOT23-6L
U206 = Power - LDO - 1.2V - 300 mA - SOT23-5L: Manufacturer PN: LDK130M12R; Manufacturer: STMicroelectronics; Power: 300mA; Tolerance: 3%; PkgCode: SOT23-5L; Value: 1.2V
U207 = Power - LDO - 2.5V - 300 mA - SOT23-5L: Manufacturer PN: LDK130M25R; Manufacturer: STMicroelectronics; Power: 300mA; Tolerance: 3%; PkgCode: SOT23-5L; Value: 2.5V

## Sheet LEDs.SchDoc
size A4; SheetNumber: 5; SheetTotal: 7
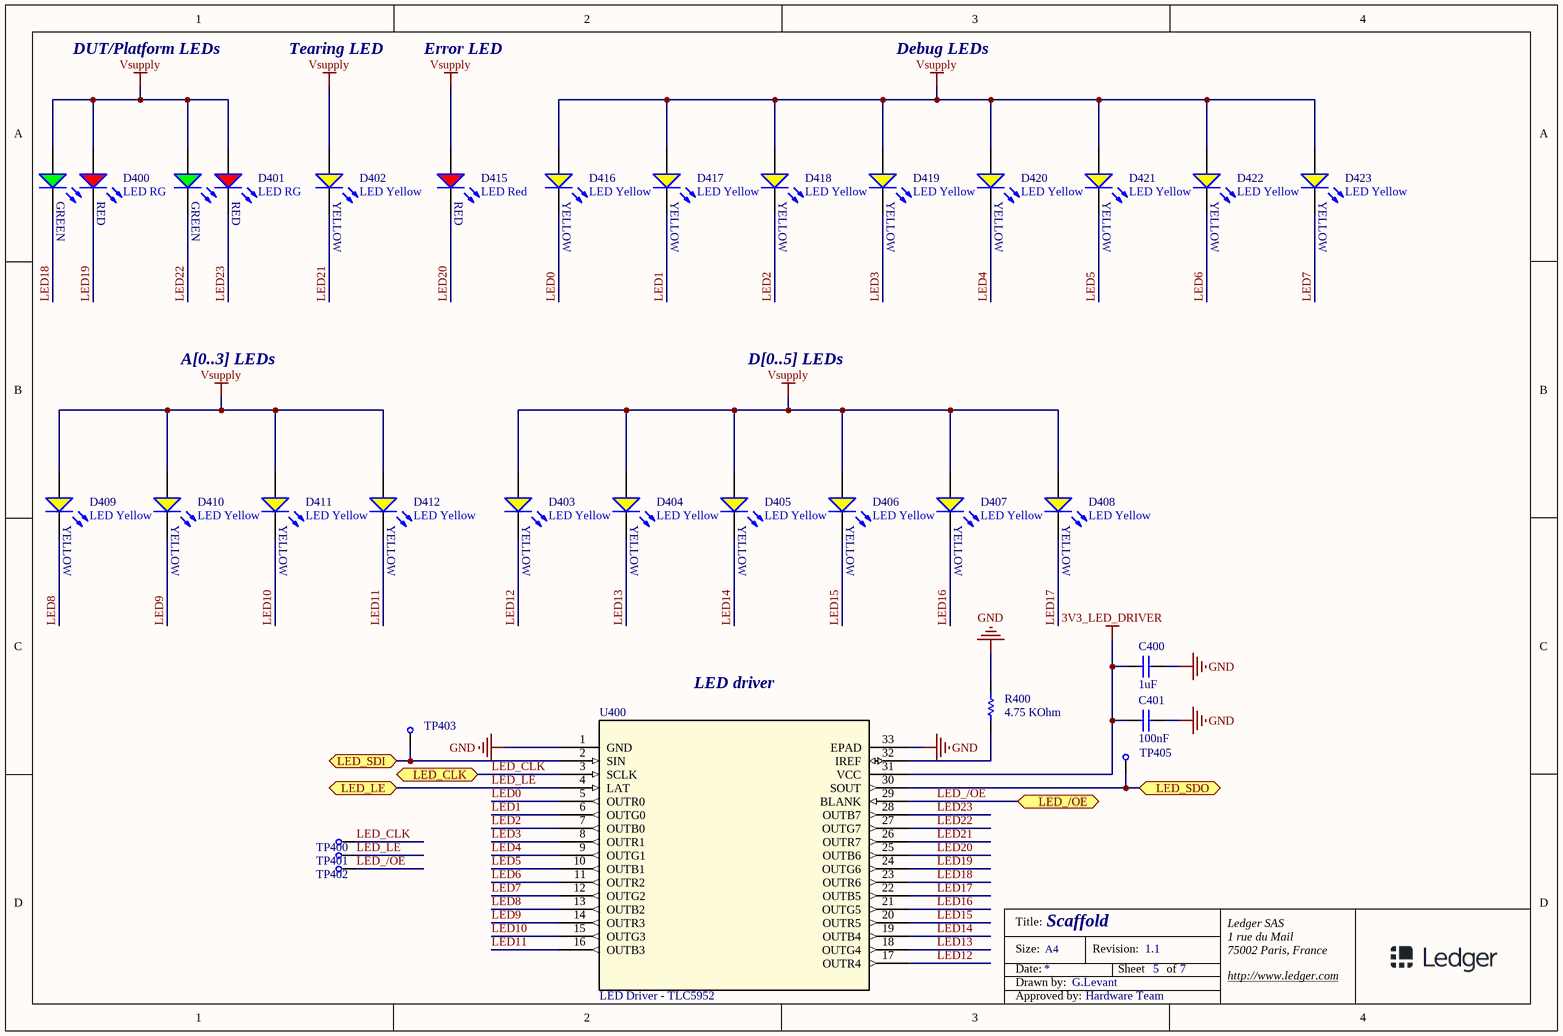
[diagram p2: LEDs.SchDoc]

### Parts
C400  1uF  [CAP0603]
C401  100nF  [CAP0603]
D400  LED RG  [PLCC-4_3528]
D401  LED RG  [PLCC-4_3528]
D402  LED Yellow  [KINGBRIGHT_AA3528]
D403  LED Yellow  [KINGBRIGHT_AA3528]
D404  LED Yellow  [KINGBRIGHT_AA3528]
D405  LED Yellow  [KINGBRIGHT_AA3528]
D406  LED Yellow  [KINGBRIGHT_AA3528]
D407  LED Yellow  [KINGBRIGHT_AA3528]
D408  LED Yellow  [KINGBRIGHT_AA3528]
D409  LED Yellow  [KINGBRIGHT_AA3528]
D410  LED Yellow  [KINGBRIGHT_AA3528]
D411  LED Yellow  [KINGBRIGHT_AA3528]
D412  LED Yellow  [KINGBRIGHT_AA3528]
D415  LED Red  [KINGBRIGHT_AA3528]
D416  LED Yellow  [KINGBRIGHT_AA3528]
D417  LED Yellow  [KINGBRIGHT_AA3528]
D418  LED Yellow  [KINGBRIGHT_AA3528]
D419  LED Yellow  [KINGBRIGHT_AA3528]
D420  LED Yellow  [KINGBRIGHT_AA3528]
D421  LED Yellow  [KINGBRIGHT_AA3528]
D422  LED Yellow  [KINGBRIGHT_AA3528]
D423  LED Yellow  [KINGBRIGHT_AA3528]
R400  4.75 KOhm  [RES0603]
TP400  (no value)  [TP_001]  (no BOM)
TP401  (no value)  [TP_001]  (no BOM)
TP402  (no value)  [TP_001]  (no BOM)
TP403  (no value)  [TP_001]  (no BOM)
TP405  (no value)  [TP_001]  (no BOM)
U400  LED Driver - TLC5952  [HTSSOP32]

### Ports
LED_/OE, LED_CLK, LED_LE, LED_SDI, LED_SDO

### Nets
3V3_LED_DRIVER: C400.1 C401.1 U400.31(VCC)
GND: C400.2 C401.2 R400.2 U400.1(GND) U400.33(EPAD)
Vsupply: D400.1(AR) D400.2(AG) D401.1(AR) D401.2(AG) D402.2(A) D403.2(A) D404.2(A) D405.2(A) D406.2(A) D407.2(A) D408.2(A) D409.2(A) D410.2(A) D411.2(A) D412.2(A) D415.2(A) D416.2(A) D417.2(A) D418.2(A) D419.2(A) D420.2(A) D421.2(A) D422.2(A) D423.2(A)
LED0: D416.1(K) U400.5(OUTR0)
LED1: D417.1(K) U400.6(OUTG0)
LED2: D418.1(K) U400.7(OUTB0)
LED3: D419.1(K) U400.8(OUTR1)
LED4: D420.1(K) U400.9(OUTG1)
LED5: D421.1(K) U400.10(OUTB1)
LED6: D422.1(K) U400.11(OUTR2)
LED7: D423.1(K) U400.12(OUTG2)
LED8: D409.1(K) U400.13(OUTB2)
LED9: D410.1(K) U400.14(OUTR3)
LED10: D411.1(K) U400.15(OUTG3)
LED11: D412.1(K) U400.16(OUTB3)
LED12: D403.1(K) U400.17(OUTR4)
LED13: D404.1(K) U400.18(OUTG4)
LED14: D405.1(K) U400.19(OUTB4)
LED15: D406.1(K) U400.20(OUTR5)
LED16: D407.1(K) U400.21(OUTG5)
LED17: D408.1(K) U400.22(OUTB5)
LED18: D400.4(KG) U400.23(OUTR6)
LED19: D400.3(KR) U400.24(OUTG6)
LED20: D415.1(K) U400.25(OUTB6)
LED21: D402.1(K) U400.26(OUTR7)
LED22: D401.4(KG) U400.27(OUTG7)
LED23: D401.3(KR) U400.28(OUTB7)
LED_/OE: TP402.1 U400.29(BLANK) ; port LED_/OE
LED_CLK: TP400.1 U400.3(SCLK) ; port LED_CLK
LED_LE: TP401.1 U400.4(LAT) ; port LED_LE
NetR400_1: R400.1 U400.32(IREF)
NetTP403_1: TP403.1 U400.2(SIN) ; port LED_SDI
NetTP405_1: TP405.1 U400.30(SOUT) ; port LED_SDO

### Notes on the sheet
- DUT/Platform LEDs
- Tearing LED
- Error LED
- Debug LEDs
- A[0..3] LEDs
- D[0..5] LEDs
- LED driver
- Title:
- Size:
- Date:
- Drawn by:
- A4
- Revision:
- Sheet
- of
- Ledger SAS
- 1 rue du Mail
- 75002 Paris, France
- http://www.ledger.com
- Approved by:
- (in symbol Opto - DEL - Red 625nm - 2mA -120 mcd) RED
- (in symbol Opto - DEL - RG 630/572nm 250/60 mcd - 20mA) GREEN; RED
- (in symbol Opto - DEL - Yellow 590nm - 2mA -30 mcd) YELLOW

### Library data of the parts
C400 = Capacitor 0603 -     1uF - 16V - X7R - 10%: as C206 on sheet Power; Value: 1uF; Type: X7R; Power: 16V; Tolerance: 10%; Manufacturer2: Wurth
C401 = Capacitor 0603 - 100nF - 16V - X7R - 10%: Manufacturer2 PN: MCCA000159; Manufacturer1: Yageo; Manufacturer1 PN: CC0603KRX7R7BB104; Manufacturer: Wurth; Manufacturer PN: 885012206046; PkgCode: 0603; Manufacturer2: Multicomp; Value: 100nF; Power: 16V; Tolerance: 10%; Type: X7R
D400 D401 = Opto - DEL - RG 630/572nm 250/60 mcd - 20mA: Manufacturer: Wurth; Manufacturer PN: 150141RV73100
D402-D412 D416-D423 = Opto - DEL - Yellow 590nm - 2mA -30 mcd: Manufacturer: Kingbright; Manufacturer PN: AA3528LSYCKT/J3
D415 = Opto - DEL - Red 625nm - 2mA -120 mcd: Manufacturer: Kingbright; Manufacturer PN: AA3528LSECKT/J3
R400 = Resistor 0603 - 4.75KOhm - 1/10W - 1%: Manufacturer: Vishay; Manufacturer PN: CRCW06034K75FKEA; PkgCode: 0603; Value: 4.75 KOhm; Tolerance: 1%; Power: 1/10W
TP400-TP403 TP405 = Misc - Test point CMS
U400 = Power - LED Driver - 24 LEDs - TLC5952 -  HTSSOP32: Manufacturer PN: TLC5952DAP; Manufacturer: Texas Instruments; PkgRef: HTSSOP32

## Sheet FPGA.SchDoc
size A3; SheetNumber: 2; SheetTotal: 7
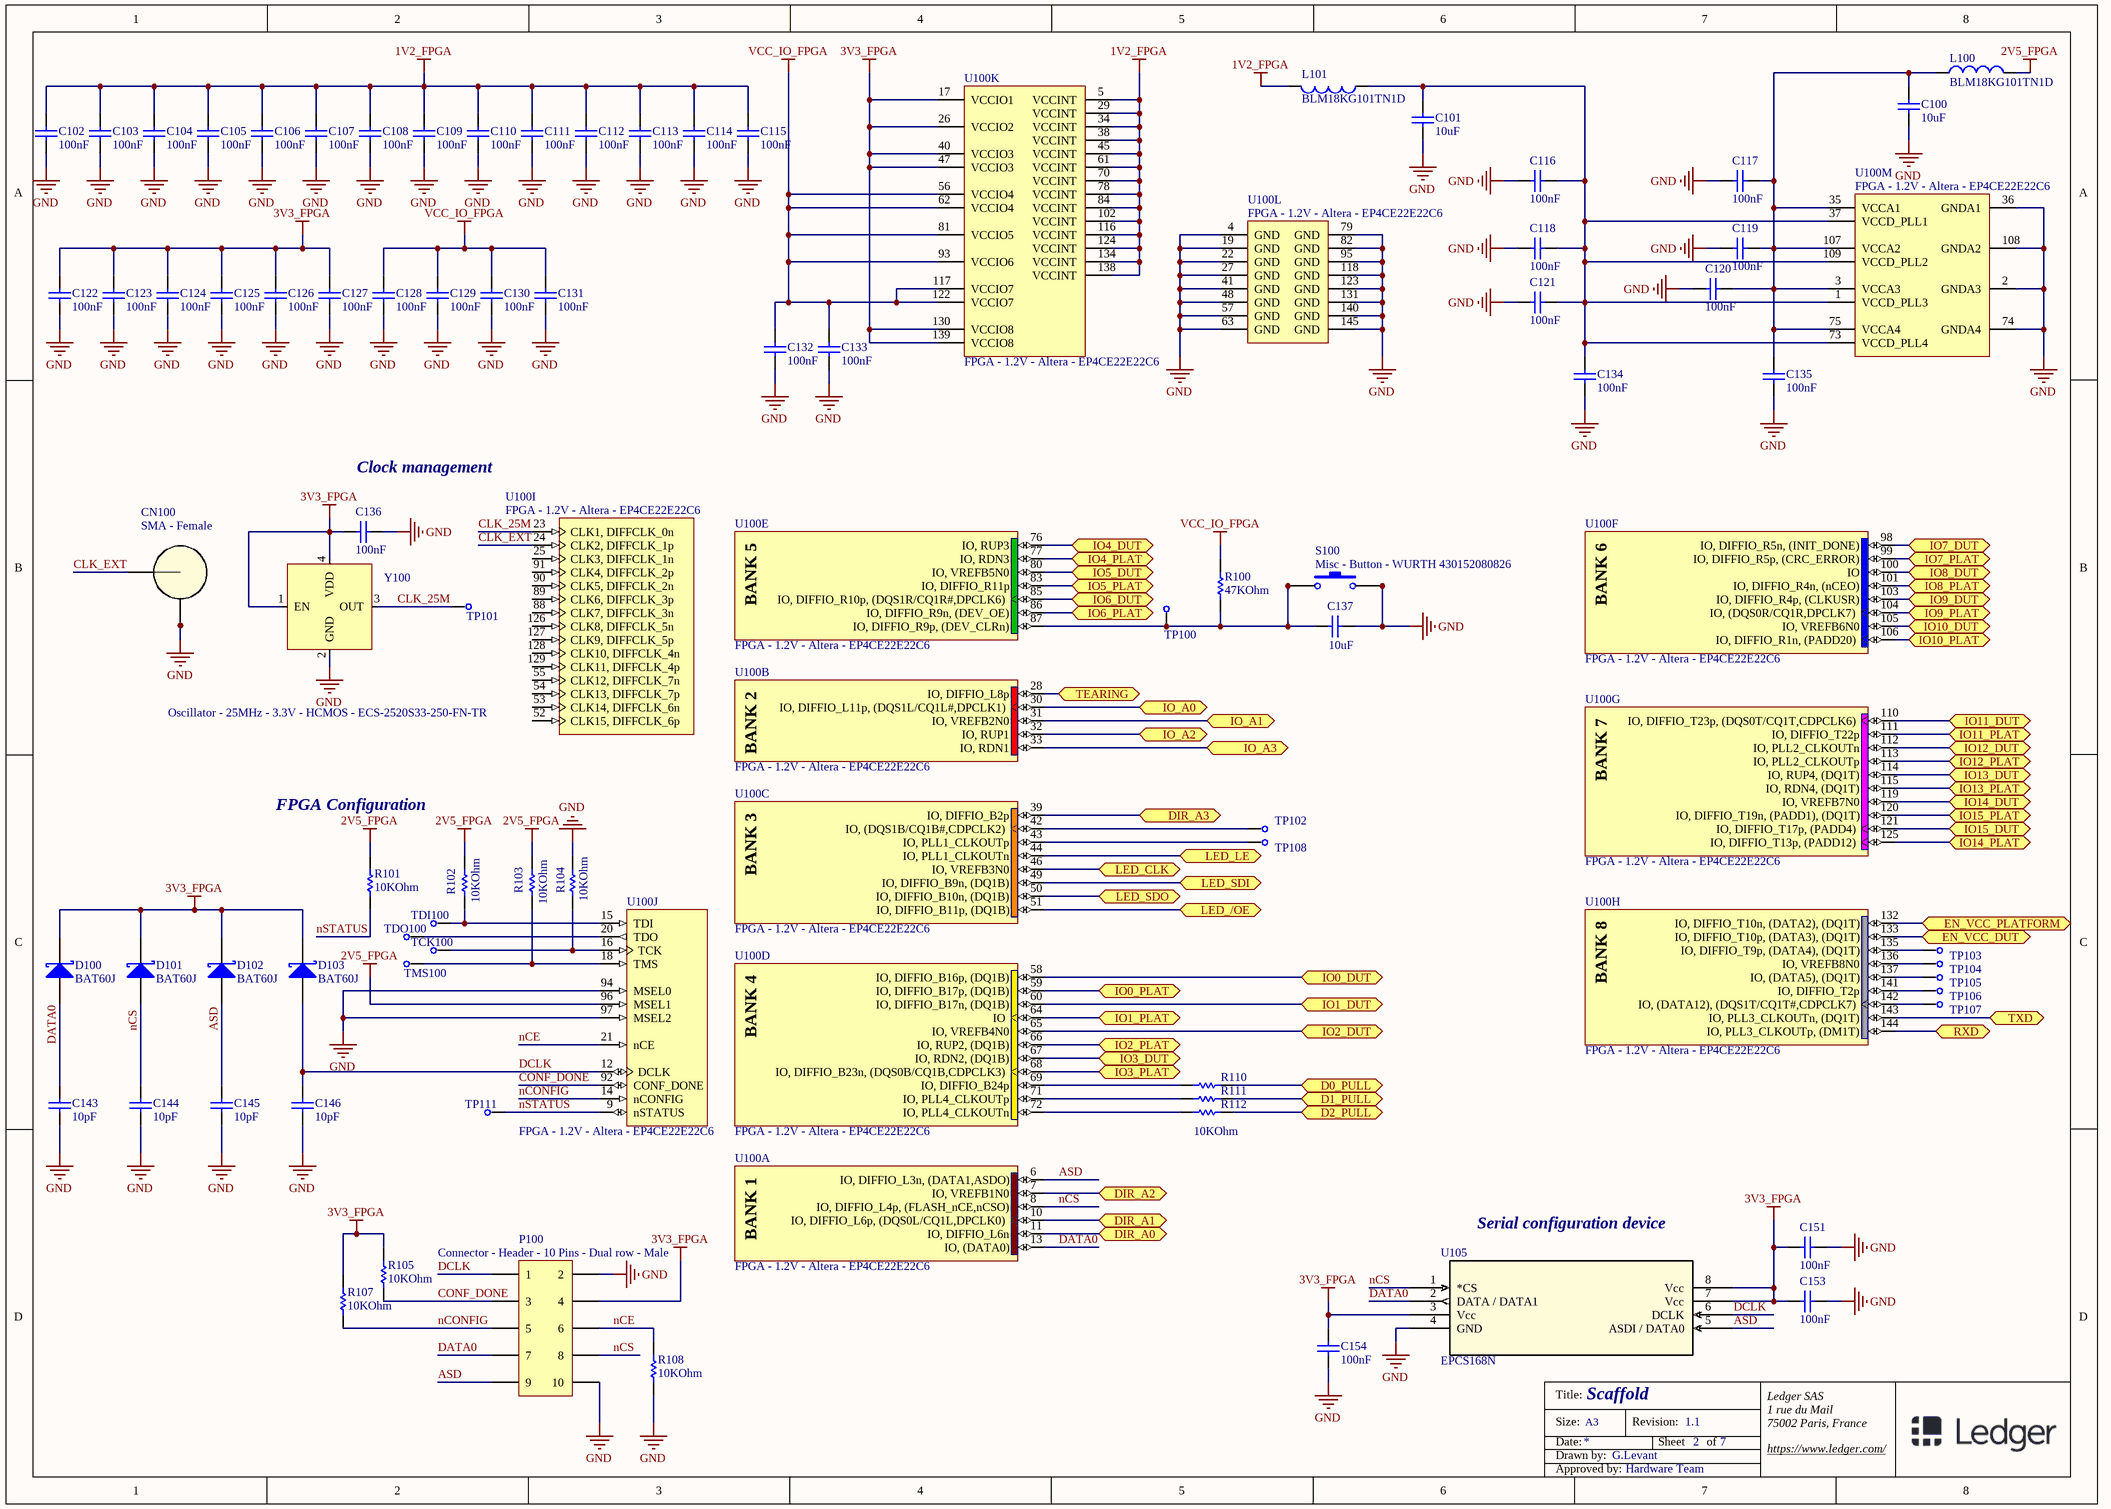
[diagram p3: FPGA.SchDoc]

### Parts
C100  10uF  [CAP0603]
C101  10uF  [CAP0603]
C102  100nF  [CAP0603]
C103  100nF  [CAP0603]
C104  100nF  [CAP0603]
C105  100nF  [CAP0603]
C106  100nF  [CAP0603]
C107  100nF  [CAP0603]
C108  100nF  [CAP0603]
C109  100nF  [CAP0603]
C110  100nF  [CAP0603]
C111  100nF  [CAP0603]
C112  100nF  [CAP0603]
C113  100nF  [CAP0603]
C114  100nF  [CAP0603]
C115  100nF  [CAP0603]
C116  100nF  [CAP0603]
C117  100nF  [CAP0603]
C118  100nF  [CAP0603]
C119  100nF  [CAP0603]
C120  100nF  [CAP0603]
C121  100nF  [CAP0603]
C122  100nF  [CAP0603]
C123  100nF  [CAP0603]
C124  100nF  [CAP0603]
C125  100nF  [CAP0603]
C126  100nF  [CAP0603]
C127  100nF  [CAP0603]
C128  100nF  [CAP0603]
C129  100nF  [CAP0603]
C130  100nF  [CAP0603]
C131  100nF  [CAP0603]
C132  100nF  [CAP0603]
C133  100nF  [CAP0603]
C134  100nF  [CAP0603]
C135  100nF  [CAP0603]
C136  100nF  [CAP0603]
C137  10uF  [CAP0603]
C143  10pF  [CAP0603]
C144  10pF  [CAP0603]
C145  10pF  [CAP0603]
C146  10pF  [CAP0603]
C151  100nF  [CAP0603]
C153  100nF  [CAP0603]
C154  100nF  [CAP0603]
CN100  SMA - Female  [SAMTEC_SMA-J-P-X-ST-EM3]
D100  BAT60J  [SOD323/A]
D101  BAT60J  [SOD323/A]
D102  BAT60J  [SOD323/A]
D103  BAT60J  [SOD323/A]
L100  BLM18KG101TN1D  [0603]
L101  BLM18KG101TN1D  [0603]
P100  Connector - Header - 10 Pins - Dual row - Male  [SAMTEC_TSW-105-07-G-D]
R100  47KOhm  [RES0603]
R101  10KOhm  [RES0603]
R102  10KOhm  [RES0603]
R103  10KOhm  [RES0603]
R104  10KOhm  [RES0603]
R105  10KOhm  [RES0603]
R107  10KOhm  [RES0603]
R108  10KOhm  [RES0603]
R110  10KOhm  [RES0603]  (value not drawn)
R111  10KOhm  [RES0603]  (value not drawn)
R112  10KOhm  [RES0603]
S100  Misc - Button - WURTH 430152080826  [430152080826]
TCK100  (no value)  [TP_001]  (no BOM)
TDI100  (no value)  [TP_001]  (no BOM)
TDO100  (no value)  [TP_001]  (no BOM)
TMS100  (no value)  [TP_001]  (no BOM)
TP100  (no value)  [TP_001]  (no BOM)
TP101  (no value)  [TP_001]  (no BOM)
TP102  (no value)  [TP_001]  (no BOM)
TP103  (no value)  [TP_001]  (no BOM)
TP104  (no value)  [TP_001]  (no BOM)
TP105  (no value)  [TP_001]  (no BOM)
TP106  (no value)  [TP_001]  (no BOM)
TP107  (no value)  [TP_001]  (no BOM)
TP108  (no value)  [TP_001]  (no BOM)
TP111  (no value)  [TP_001]  (no BOM)
U100  FPGA - 1.2V - Altera - EP4CE22E22C6  [EQFP144_M]  (parts A,B,C,D,E,F,G,H,I,J,K,L,M of 13)
U105  EPCS168N  [8-SOIC-M]
Y100  Oscillator - 25MHz - 3.3V - HCMOS - ECS-2520S33-250-FN-TR  [XTAL_2520]

### Ports
D0_PULL, D1_PULL, D2_PULL, DIR_A0, DIR_A1, DIR_A2, DIR_A3, EN_VCC_DUT, EN_VCC_PLATFORM, IO0_DUT, IO0_PLAT, IO1_DUT, IO1_PLAT, IO2_DUT, IO2_PLAT, IO3_DUT, IO3_PLAT, IO4_DUT, IO4_PLAT, IO5_DUT, IO5_PLAT, IO6_DUT, IO6_PLAT, IO7_DUT, IO7_PLAT, IO8_DUT, IO8_PLAT, IO9_DUT, IO9_PLAT, IO10_DUT, IO10_PLAT, IO11_DUT, IO11_PLAT, IO12_DUT, IO12_PLAT, IO13_DUT, IO13_PLAT, IO14_DUT, IO14_PLAT, IO15_DUT, IO15_PLAT, IO_A0, IO_A1, IO_A2, IO_A3, LED_/OE, LED_CLK, LED_LE, LED_SDI, LED_SDO, RXD, TEARING, TXD

### Nets
1V2_FPGA: C102.2 C103.2 C104.2 C105.2 C106.2 C107.2 C108.2 C109.2 C110.2 C111.2 C112.2 C113.2 C114.2 C115.2 L101.2 U100.5(VCCINT) U100.29(VCCINT) U100.34(VCCINT) U100.38(VCCINT) U100.45(VCCINT) U100.61(VCCINT) U100.70(VCCINT) U100.78(VCCINT) U100.84(VCCINT) U100.102(VCCINT) U100.116(VCCINT) U100.124(VCCINT) U100.134(VCCINT) U100.138(VCCINT)
2V5_FPGA: L100.2 R101.2 R102.2 R103.2 U100.96(MSEL1)
3V3_FPGA: C122.2 C123.2 C124.2 C125.2 C126.2 C127.2 C136.1 C151.2 C153.2 C154.2 D100.2(K) D101.2(K) D102.2(K) D103.2(K) P100.4 R105.2 R107.2 U100.17(VCCIO1) U100.26(VCCIO2) U100.40(VCCIO3) U100.47(VCCIO3) U100.130(VCCIO8) U100.139(VCCIO8) U105.3(Vcc) U105.7(Vcc) U105.8(Vcc) Y100.1(EN) Y100.4(VDD)
GND: C100.1 C101.1 C102.1 C103.1 C104.1 C105.1 C106.1 C107.1 C108.1 C109.1 C110.1 C111.1 C112.1 C113.1 C114.1 C115.1 C116.1 C117.1 C118.1 C119.1 C120.1 C121.1 C122.1 C123.1 C124.1 C125.1 C126.1 C127.1 C128.1 C129.1 C130.1 C131.1 C132.1 C133.1 C134.1 C135.1 C136.2 C137.1 C143.1 C144.1 C145.1 C146.1 C151.1 C153.1 C154.1 CN100.2 CN100.3 P100.2 P100.10 R104.2 R108.1 S100.2 S100.4 U100.2(GNDA3) U100.4(GND) U100.19(GND) U100.22(GND) U100.27(GND) U100.36(GNDA1) U100.41(GND) U100.48(GND) U100.57(GND) U100.63(GND) U100.74(GNDA4) U100.79(GND) U100.82(GND) U100.94(MSEL0) U100.95(GND) U100.97(MSEL2) U100.108(GNDA2) U100.118(GND) U100.123(GND) U100.131(GND) U100.140(GND) U100.145(GND) U105.4(GND) Y100.2(GND)
VCC_IO_FPGA: C128.2 C129.2 C130.2 C131.2 C132.2 C133.2 R100.2 U100.56(VCCIO4) U100.62(VCCIO4) U100.81(VCCIO5) U100.93(VCCIO6) U100.117(VCCIO7) U100.122(VCCIO7)
ASD: C145.2 D102.1(A) P100.9 U100.6(IO,_DIFFIO_L3n,_(DATA1,ASDO)) U105.5(ASDI_/_DATA0)
CLK_25M: TP101.1 U100.23(CLK1,_DIFFCLK_0n) Y100.3(OUT)
CLK_EXT: CN100.1 U100.24(CLK2,_DIFFCLK_1p)
CONF_DONE: P100.3 R105.1 U100.92(CONF_DONE)
DATA0: C143.2 D100.1(A) P100.7 U100.13(IO,_(DATA0)) U105.2(DATA_/_DATA1)
DCLK: C146.2 D103.1(A) P100.1 U100.12(DCLK) U105.6(DCLK)
DUT_D0: R110.2 ; port D0_PULL
DUT_D1: R111.2 ; port D1_PULL
DUT_D2: R112.1 ; port D2_PULL
IO0_DUT: U100.58(IO,_DIFFIO_B16p,_(DQ1B)) ; port IO0_DUT
IO1_DUT: U100.60(IO,_DIFFIO_B17n,_(DQ1B)) ; port IO1_DUT
IO2_DUT: U100.65(IO,_VREFB4N0) ; port IO2_DUT
IO3_DUT: U100.67(IO,_RDN2,_(DQ1B)) ; port IO3_DUT
IO4_DUT: U100.76(IO,_RUP3) ; port IO4_DUT
IO5_DUT: U100.80(IO,_VREFB5N0) ; port IO5_DUT
IO6_DUT: U100.85(IO,_DIFFIO_R10p,_(DQS1R/CQ1R#,DPCLK6)) ; port IO6_DUT
IO7_DUT: U100.98(IO,_DIFFIO_R5n,_(INIT_DONE)) ; port IO7_DUT
IO8_DUT: U100.100(IO) ; port IO8_DUT
IO9_DUT: U100.103(IO,_DIFFIO_R4p,_(CLKUSR)) ; port IO9_DUT
IO10_DUT: U100.105(IO,_VREFB6N0) ; port IO10_DUT
IO11_DUT: U100.110(IO,_DIFFIO_T23p,_(DQS0T/CQ1T,CDPCLK6)) ; port IO11_DUT
IO12_DUT: U100.112(IO,_PLL2_CLKOUTn) ; port IO12_DUT
IO13_DUT: U100.114(IO,_RUP4,_(DQ1T)) ; port IO13_DUT
IO14_DUT: U100.119(IO,_VREFB7N0) ; port IO14_DUT
IO15_DUT: U100.121(IO,_DIFFIO_T17p,_(PADD4)) ; port IO15_DUT
LED_/OE: U100.51(IO,_DIFFIO_B11p,_(DQ1B)) ; port LED_/OE
LED_CLK: U100.46(IO,_VREFB3N0) ; port LED_CLK
LED_LE: U100.44(IO,_PLL1_CLKOUTn) ; port LED_LE
nCE: P100.6 R108.2 U100.21(nCE)
nCONFIG: P100.5 R107.1 U100.14(nCONFIG)
nCS: C144.2 D101.1(A) P100.8 U100.8(IO,_DIFFIO_L4p,_(FLASH_nCE,nCSO)) U105.1(*CS)
nSTATUS: R101.1 TP111.1 U100.9(nSTATUS)
NetC100_2: C100.2 C117.2 C119.2 C120.2 C135.2 L100.1 U100.3(VCCA3) U100.35(VCCA1) U100.75(VCCA4) U100.107(VCCA2)
NetC101_2: C101.2 C116.2 C118.2 C121.2 C134.2 L101.1 U100.1(VCCD_PLL3) U100.37(VCCD_PLL1) U100.73(VCCD_PLL4) U100.109(VCCD_PLL2)
NetC137_2: C137.2 R100.1 S100.1 S100.3 TP100.1 U100.87(IO,_DIFFIO_R9p,_(DEV_CLRn))
NetJ500_1: U100.64(IO) ; port IO1_PLAT
NetJ500_2: U100.59(IO,_DIFFIO_B17p,_(DQ1B)) ; port IO0_PLAT
NetJ500_3: U100.68(IO,_DIFFIO_B23n,_(DQS0B/CQ1B,CDPCLK3)) ; port IO3_PLAT
NetJ500_4: U100.66(IO,_RUP2,_(DQ1B)) ; port IO2_PLAT
NetJ500_5: U100.83(IO,_DIFFIO_R11p) ; port IO5_PLAT
NetJ500_6: U100.77(IO,_RDN3) ; port IO4_PLAT
NetJ500_7: U100.99(IO,_DIFFIO_R5p,_(CRC_ERROR)) ; port IO7_PLAT
NetJ500_8: U100.86(IO,_DIFFIO_R9n,_(DEV_OE)) ; port IO6_PLAT
NetJ500_9: U100.104(IO,_(DQS0R/CQ1R,DPCLK7)) ; port IO9_PLAT
NetJ500_10: U100.101(IO,_DIFFIO_R4n,_(nCEO)) ; port IO8_PLAT
NetJ500_11: U100.111(IO,_DIFFIO_T22p) ; port IO11_PLAT
NetJ500_12: U100.106(IO,_DIFFIO_R1n,_(PADD20)) ; port IO10_PLAT
NetJ500_13: U100.115(IO,_RDN4,_(DQ1T)) ; port IO13_PLAT
NetJ500_14: U100.113(IO,_PLL2_CLKOUTp) ; port IO12_PLAT
NetJ500_15: U100.120(IO,_DIFFIO_T19n,_(PADD1),_(DQ1T)) ; port IO15_PLAT
NetJ500_16: U100.125(IO,_DIFFIO_T13p,_(PADD12)) ; port IO14_PLAT
NetQ202_3: U100.132(IO,_DIFFIO_T10n,_(DATA2),_(DQ1T)) ; port EN_VCC_PLATFORM
NetQ205_3: U100.133(IO,_DIFFIO_T10p,_(DATA3),_(DQ1T)) ; port EN_VCC_DUT
NetR102_1: R102.1 TDI100.1 U100.15(TDI)
NetR103_1: R103.1 TMS100.1 U100.18(TMS)
NetR104_1: R104.1 TCK100.1 U100.16(TCK)
NetR110_1: R110.1 U100.69(IO,_DIFFIO_B24p)
NetR111_1: R111.1 U100.71(IO,_PLL4_CLKOUTp)
NetR112_2: R112.2 U100.72(IO,_PLL4_CLKOUTn)
NetR300_1: U100.28(IO,_DIFFIO_L8p) ; port TEARING
NetR600_1: U100.11(IO,_DIFFIO_L6n) ; port DIR_A0
NetR601_1: U100.10(IO,_DIFFIO_L6p,_(DQS0L/CQ1L,DPCLK0)) ; port DIR_A1
NetR602_1: U100.7(IO,_VREFB1N0) ; port DIR_A2
NetR604_1: U100.39(IO,_DIFFIO_B2p) ; port DIR_A3
NetTDO100_1: TDO100.1 U100.20(TDO)
NetTP102_1: TP102.1 U100.42(IO,_(DQS1B/CQ1B#,CDPCLK2))
NetTP103_1: TP103.1 U100.135(IO,_DIFFIO_T9p,_(DATA4),_(DQ1T))
NetTP104_1: TP104.1 U100.136(IO,_VREFB8N0)
NetTP105_1: TP105.1 U100.137(IO,_(DATA5),_(DQ1T))
NetTP106_1: TP106.1 U100.141(IO,_DIFFIO_T2p)
NetTP107_1: TP107.1 U100.142(IO,_(DATA12),_(DQS1T/CQ1T#,CDPCLK7))
NetTP108_1: TP108.1 U100.43(IO,_PLL1_CLKOUTp)
NetTP403_1: U100.49(IO,_DIFFIO_B9n,_(DQ1B)) ; port LED_SDI
NetTP405_1: U100.50(IO,_DIFFIO_B10n,_(DQ1B)) ; port LED_SDO
NetTP600_1: U100.144(IO,_PLL3_CLKOUTp,_(DM1T)) ; port RXD
NetTP602_1: U100.143(IO,_PLL3_CLKOUTn,_(DQ1T)) ; port TXD
NetU100_30: U100.30(IO,_DIFFIO_L11p,_(DQS1L/CQ1L#,DPCLK1)) ; port IO_A0
NetU100_31: U100.31(IO,_VREFB2N0) ; port IO_A1
NetU100_32: U100.32(IO,_RUP1) ; port IO_A2
NetU100_33: U100.33(IO,_RDN1) ; port IO_A3

Not connected (* = marked no-connect by the designer): U100 25(CLK3,_DIFFCLK_1n) 52(CLK15,_DIFFCLK_6p) 53(CLK14,_DIFFCLK_6n) 54(CLK13,_DIFFCLK_7p) 55(CLK12,_DIFFCLK_7n) 88(CLK7,_DIFFCLK_3n) 89(CLK6,_DIFFCLK_3p) 90(CLK5,_DIFFCLK_2n) 91(CLK4,_DIFFCLK_2p) 126(CLK8,_DIFFCLK_5n) 127(CLK9,_DIFFCLK_5p) 128(CLK10,_DIFFCLK_4n) 129(CLK11,_DIFFCLK_4p)

### Notes on the sheet
- Clock management
- FPGA Configuration
- Serial configuration device
- Title:
- Size:
- Date:
- Drawn by:
- A3
- Revision:
- Sheet
- of
- Ledger SAS
- 1 rue du Mail
- 75002 Paris, France
- https://www.ledger.com/
- Approved by:
- (in symbol FPGA - 1.2V - Altera - EP4CE22E22C6, part A) BANK 1
- (in symbol FPGA - 1.2V - Altera - EP4CE22E22C6, part B) BANK 2
- (in symbol FPGA - 1.2V - Altera - EP4CE22E22C6, part C) BANK 3
- (in symbol FPGA - 1.2V - Altera - EP4CE22E22C6, part D) BANK 4
- (in symbol FPGA - 1.2V - Altera - EP4CE22E22C6, part E) BANK 5
- (in symbol FPGA - 1.2V - Altera - EP4CE22E22C6, part F) BANK 6
- (in symbol FPGA - 1.2V - Altera - EP4CE22E22C6, part G) BANK 7
- (in symbol FPGA - 1.2V - Altera - EP4CE22E22C6, part H) BANK 8

### Library data of the parts
C100 C101 C137 = Capacitor 0603 - 10uF - 16V - X5R - 20%: as C200 on sheet Power; value: 10uF; Type: X5R; Tolerance: 20%; Power: 16V; Manufacturer2: Taiyo Yuden
C102-C135 C151 C153 C154 = Capacitor 0603 - 100nF - 16V - X7R - 10%: as C401 on sheet LEDs; Manufacturer2: Multicomp; Value: 100nF; Power: 16V; Tolerance: 10%; Type: X7R
C136 = Capacitor 0603 - 100nF - 16V - X7R - 10%: Manufacturer: Wurth; Manufacturer PN: 885012206046; Manufacturer1: Yageo; Manufacturer1 PN: CC0603KRX7R7BB104; Manufacturer2 PN: MCCA000159; PkgCode: 0603; Value: 100nF; Power: 16V; Tolerance: 10%; Type: X7R; Manufacturer2: Multicomp
C143-C146 = Capacitor 0603 -  10pF - 100V - COG - 5%: Manufacturer: TDK; Manufacturer PN: C1608C0G2A100D; Manufacturer1: Murata; Manufacturer1 PN: GCM1885C2A100J; Manufacturer2 PN: CL10C100JC81PB; PkgCode: 0603; Value: 10pF; Power: 100V; Tolerance: 5%; Type: COG; Manufacturer2: Samsung
CN100 = Connector - SMA - Female - Horizontal - Mid Mount - Samtec - SMA–J–P–H–ST–EM3: pin to pad: 1>S1 2>G1 3>G2; Impedance: 50 Ohms; Manufacturer: Samtec; Manufacturer PN: SMA–J–P–H–ST–EM3; Type: SMA; Gender: Female
D100-D103 = Diode -Schottky -10V - 3 A - SOD−323 - BAT60J: as D200 on sheet Power; Manufacturer PN: BAT60J
L100 L101 = Ferrite - Bead - 0603 BLM18: as L200 on sheet Power; Manufacturer PN: BLM18KG101TN1D; Pkgref: 0603
P100 = Connector - Header - 10 Pins - Dual row - Male: Manufacturer: Samtec; Manufacturer PN: TSW-105-07-G-D; NoPins: 10; Rows: 2
R100 = Resistor 0603 -   47KOhm - 1/10W - 1%: Manufacturer PN: RC0603FR-0747KL; Manufacturer: YAGEO; PkgCode: 0603; Value: 47KOhm; Tolerance: 1%; Power: 1/10W
R101-R105 R107 R108 R110-R112 = Resistor 0603 -    10KOhm - 1/10W - 1%: Manufacturer: Yageo; Manufacturer PN: RC0603FR-0710KL; Manufacturer1: Panasonic; Manufacturer1 PN: ERJ3EKF1002; Manufacturer2 PN: RK73H1JHT..1002F; PkgCode: 0603; Value: 10KOhm; Tolerance: 1%; Power: 1/10W; Manufacturer2: KOA Speer
S100 = Misc - Button - WURTH 430152080826: Manufacturer: Wurth Elektronik; Rated Current: 50 mA; Operation Force: 260 gf; Rated Voltage: 12 VDC; Manufacturer PN: 430152080826; Size: 6x6x8 mm
TCK100 TDI100 TDO100 TMS100 TP100-TP108 TP111 = Misc - Test point CMS
U100 = FPGA - 1.2V - Altera - EP4CE22E22C6: PkgRef: EQFP144; Manufacturer PN: EP4CE22E22C6; Manufacturer: Altera
U105 = IC - Serial configuration device - 16Mbits - SOIC8 - Altera - EPCS168N: Manufacturer: Altera / Intel; Manufacturer PN: EPCS16SI8N; Manufacturer1 PN: EPCQ16ASI8N; Manufacturer1: Altera / Intel
Y100 = Oscillator - 25MHz - 3.3V - HCMOS - ECS-2520S33-250-FN-TR: Manufacturer: ECS; Manufacturer PN: ECS-2520S33-250-FN-TR

## Sheet DUT_Platform.SchDoc
size A4; SheetNumber: 6; SheetTotal: 7
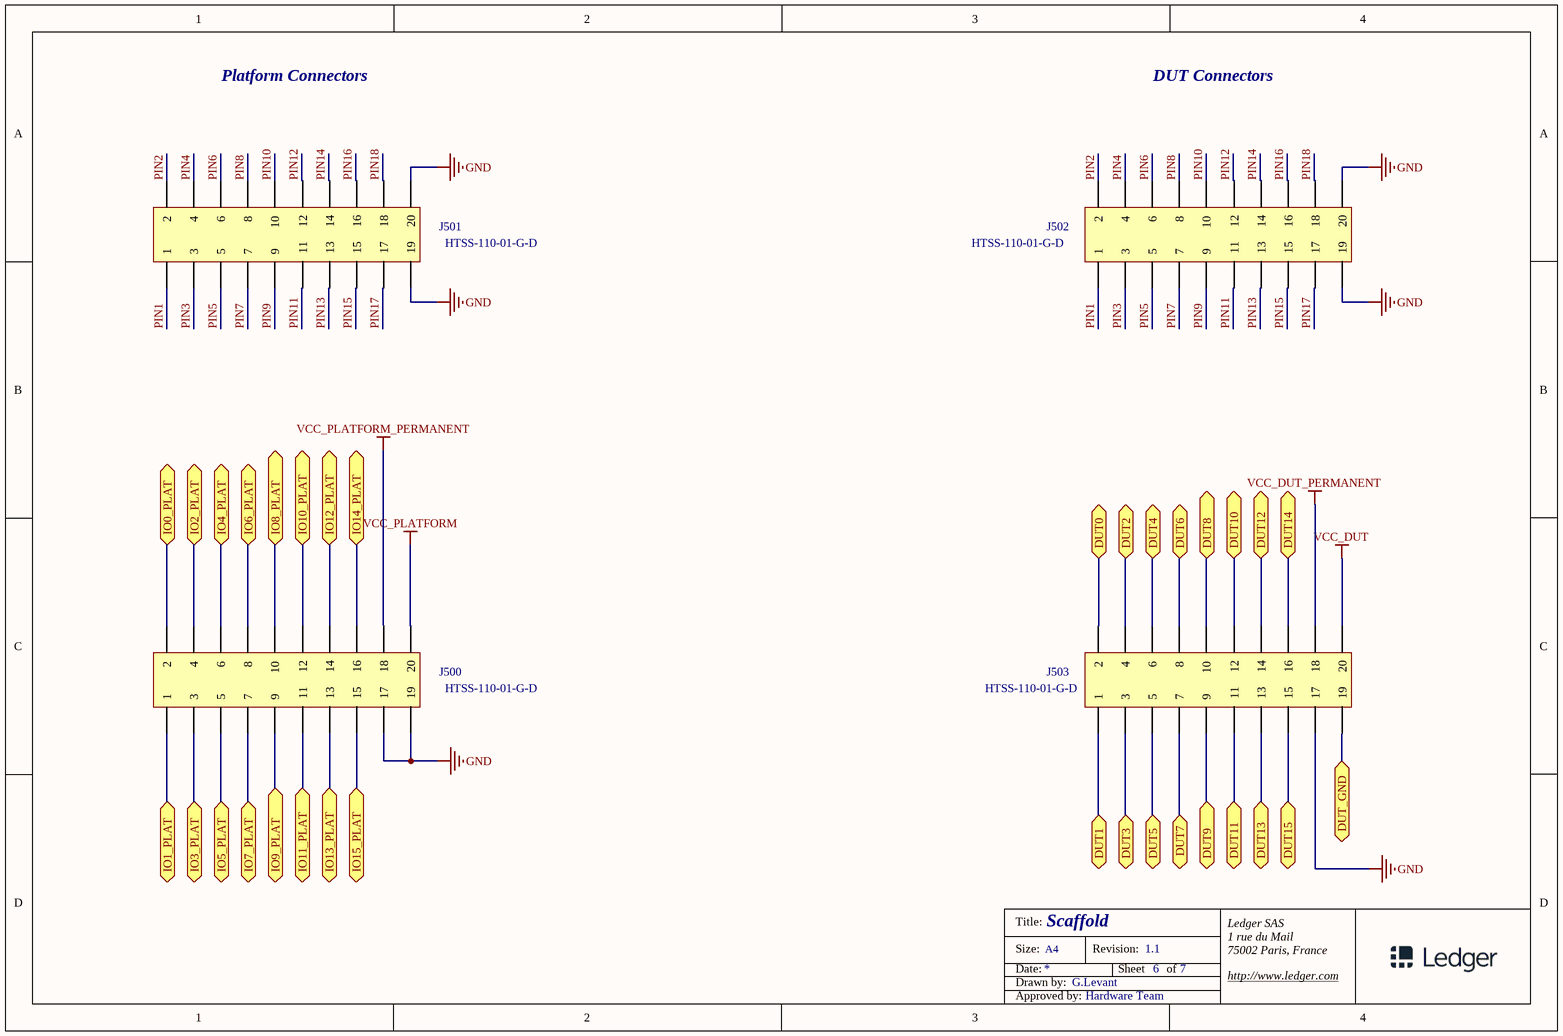
[diagram p4: DUT_Platform.SchDoc]

### Parts
J500  HTSS-110-01-G-D  [SAMTEC_HTSS-110-01-G-D]
J501  HTSS-110-01-G-D  [SAMTEC_HTSS-110-01-G-D]
J502  HTSS-110-01-G-D  [SAMTEC_HTSS-110-01-G-D]
J503  HTSS-110-01-G-D  [SAMTEC_HTSS-110-01-G-D]

### Ports
DUT0, DUT1, DUT2, DUT3, DUT4, DUT5, DUT6, DUT7, DUT8, DUT9, DUT10, DUT11, DUT12, DUT13, DUT14, DUT15, DUT_GND, IO0_PLAT, IO1_PLAT, IO2_PLAT, IO3_PLAT, IO4_PLAT, IO5_PLAT, IO6_PLAT, IO7_PLAT, IO8_PLAT, IO9_PLAT, IO10_PLAT, IO11_PLAT, IO12_PLAT, IO13_PLAT, IO14_PLAT, IO15_PLAT

### Nets
GND: J500.17 J500.19 J501.19 J501.20 J502.19 J502.20 J503.17
VCC_DUT: J503.20
VCC_DUT_PERMANENT: J503.18
VCC_PLATFORM: J500.20
VCC_PLATFORM_PERMANENT: J500.18
DUT_D0: J503.2 ; port DUT0
DUT_D1: J503.1 ; port DUT1
DUT_D2: J503.4 ; port DUT2
PIN1: J501.1 J502.1
PIN2: J501.2 J502.2
PIN3: J501.3 J502.3
PIN4: J501.4 J502.4
PIN5: J501.5 J502.5
PIN6: J501.6 J502.6
PIN7: J501.7 J502.7
PIN8: J501.8 J502.8
PIN9: J501.9 J502.9
PIN10: J501.10 J502.10
PIN11: J501.11 J502.11
PIN12: J501.12 J502.12
PIN13: J501.13 J502.13
PIN14: J501.14 J502.14
PIN15: J501.15 J502.15
PIN16: J501.16 J502.16
PIN17: J501.17 J502.17
PIN18: J501.18 J502.18
NetCN207_1: J503.19 ; port DUT_GND
NetJ500_1: J500.1 ; port IO1_PLAT
NetJ500_2: J500.2 ; port IO0_PLAT
NetJ500_3: J500.3 ; port IO3_PLAT
NetJ500_4: J500.4 ; port IO2_PLAT
NetJ500_5: J500.5 ; port IO5_PLAT
NetJ500_6: J500.6 ; port IO4_PLAT
NetJ500_7: J500.7 ; port IO7_PLAT
NetJ500_8: J500.8 ; port IO6_PLAT
NetJ500_9: J500.9 ; port IO9_PLAT
NetJ500_10: J500.10 ; port IO8_PLAT
NetJ500_11: J500.11 ; port IO11_PLAT
NetJ500_12: J500.12 ; port IO10_PLAT
NetJ500_13: J500.13 ; port IO13_PLAT
NetJ500_14: J500.14 ; port IO12_PLAT
NetJ500_15: J500.15 ; port IO15_PLAT
NetJ500_16: J500.16 ; port IO14_PLAT
NetJ503_3: J503.3 ; port DUT3
NetJ503_5: J503.5 ; port DUT5
NetJ503_6: J503.6 ; port DUT4
NetJ503_7: J503.7 ; port DUT7
NetJ503_8: J503.8 ; port DUT6
NetJ503_9: J503.9 ; port DUT9
NetJ503_10: J503.10 ; port DUT8
NetJ503_11: J503.11 ; port DUT11
NetJ503_12: J503.12 ; port DUT10
NetJ503_13: J503.13 ; port DUT13
NetJ503_14: J503.14 ; port DUT12
NetJ503_15: J503.15 ; port DUT15
NetJ503_16: J503.16 ; port DUT14

### Notes on the sheet
- Platform Connectors
- DUT Connectors
- Title:
- Size:
- Date:
- Drawn by:
- A4
- Revision:
- Sheet
- of
- Ledger SAS
- 1 rue du Mail
- 75002 Paris, France
- http://www.ledger.com
- Approved by:

### Library data of the parts
J500-J503 = Connector - Header - 20 Pins - Dual row - Shrouded - Male: Manufacturer: Samtec; NoPins: 20; Rows: 2; Manufacturer PN: HTSS-110-01-G-D